# EasyEDA Pro project ProPrj_ArpiGlasses_Final2_2025-06-16.epro, board PCB_ArpiGlasses_1
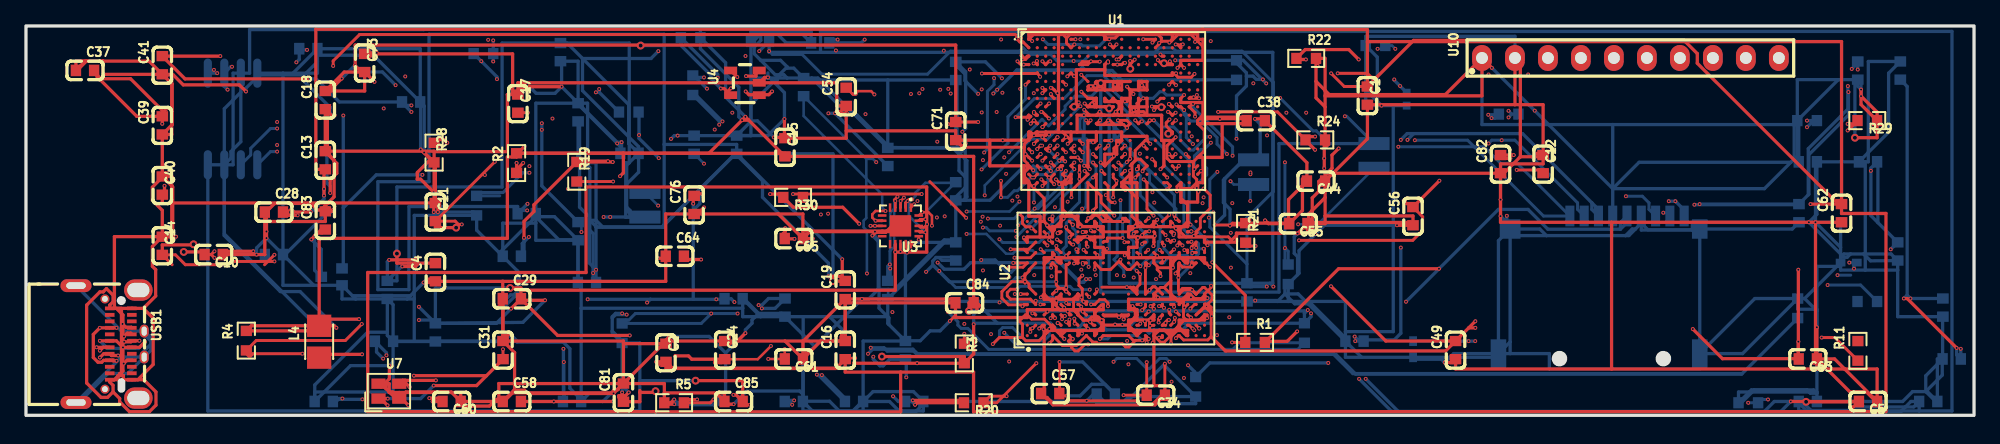
[diagram p3: board, top side]
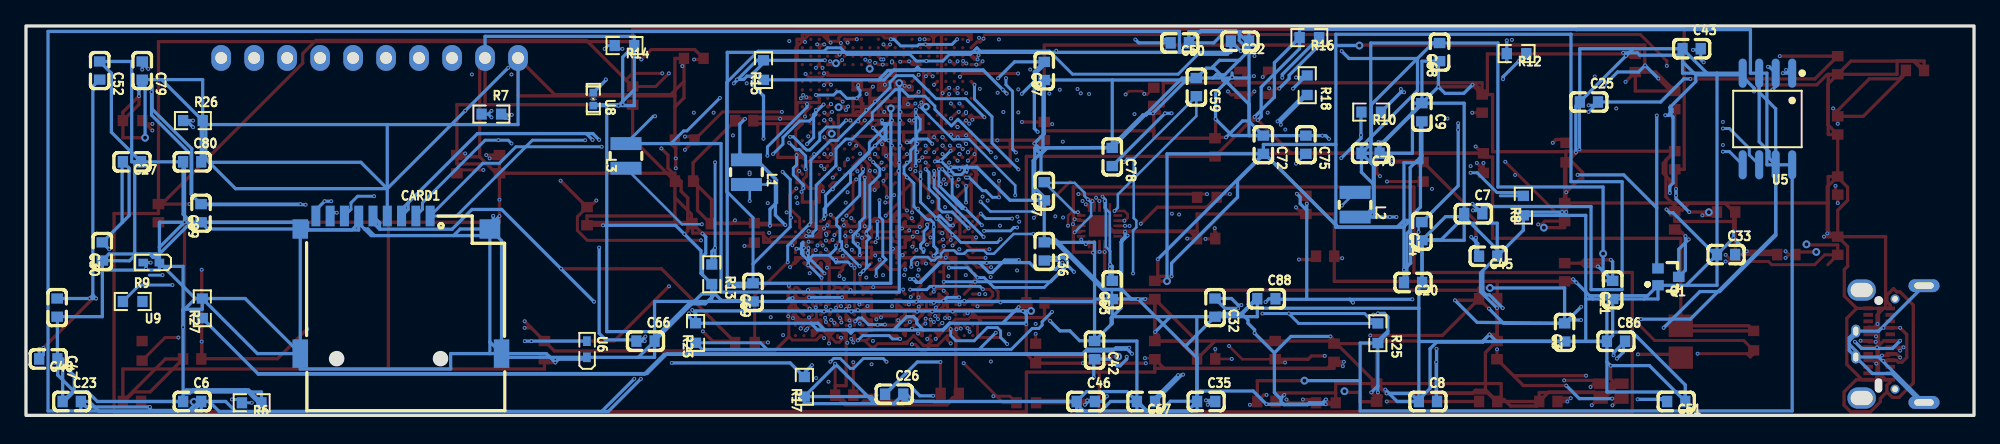
[diagram p4: board, bottom side, seen from below]

Outline 150 x 30 mm; copper layers: Top Layer, GND, Inner2, Inner3, Inner4, Bottom Layer. Coordinates in mm from the lower left corner of the outline.
Outline path: rectangle 0,30 150,0
Stack: Top Layer 0.035mm Outer layer thickness 1oz / Dielectric1 0.0994mm 3313 RC57% 4.2mil / GND 0.0152mm Inner layer thickness / Dielectric2 0.55mm 0.55mm H/H No copper / Inner2 0.0152mm Inner layer thickness / Dielectric3 0.1088mm 2116 RC54% 4.9mil / Inner3 0.0152mm Inner layer thickness / Dielectric4 0.55mm 0.55mm H/H No copper / Inner4 0.0152mm Inner layer thickness / Dielectric5 0.0994mm 3313 RC57% 4.2mil / Bottom Layer 0.035mm Outer layer thickness 1oz

## Design rules (mm)
template: User Custom Config
spacing Default (default): track to track 0.076, other pairs 0.076 to 0.076
track width Default (default): min 0.254, default 0.254, max 25.4
differential pair differentialPair (default): width min 0.127, default 0.254, max 2.54; gap min 0.152, default 0.152
via Default (default): diameter min 0.305, default 0.305, max 100.025; hole min 0.152, default 0.152, max 59.995

## Placement (name value [footprint] x y rotation side)
C1  2.2uf  [C0603]  103.29 24.63 270 top
C2  100nf  [C0603]  49.28 4.82 270 top
C3  22uf  [C0603]  31.52 6.39 90 bottom
C4  22uf  [C0603]  31.52 11.02 90 top
C5  22uf  [C0603]  141.84 1.07 180 top
C6  22uf  [C0603]  137.2 1.07 180 bottom
C7  22uf  [C0603]  38.56 15.53 180 bottom
C8  22uf  [C0603]  42.05 1.07 180 bottom
C9  22uf  [C0603]  42.51 23.35 270 bottom
C10  10uf  [C0603]  14.45 12.38 180 top
C11  220nf  [C0603]  31.52 15.66 270 top
C12  1uf  [C0603]  116.82 19.35 270 top
C13  100nf  [C0603]  23.05 19.65 90 top
C14  470nf  [C0603]  10.5 13.06 270 top
C15  1uf  [C0603]  58.44 20.65 270 top
C16  2.2uf  [C0603]  63.08 5.02 90 top
C17  470nf  [C0603]  37.88 24.02 270 top
C18  2.2uf  [C0603]  23.05 24.29 90 top
C19  2.2uf  [C0603]  63.08 9.66 90 top
C20  2.2uf  [C0603]  43.19 10.23 0 bottom
C21  2.2uf  [C0603]  27.83 9.66 90 bottom
C22  2.2uf  [C0603]  56.52 28.82 0 bottom
C23  2.2uf  [C0603]  146.48 1.07 180 bottom
C24  10uf  [C0603]  53.81 5.02 270 top
C25  2.2uf  [C0603]  29.66 24.14 180 bottom
C26  10uf  [C0603]  83.15 1.63 180 bottom
C27  100nf  [C0603]  141.84 19.53 0 bottom
C28  100nf  [C0603]  19.09 15.66 0 top
C29  100nf  [C0603]  37.41 8.98 0 top
C30  100nf  [C0603]  144.12 12.62 90 bottom
C31  12pf  [C0603]  36.73 5.02 90 top
C32  12pf  [C0603]  58.44 8.3 270 bottom
C33  1nf  [C0603]  19.09 12.38 180 bottom
C34  22uf  [C0603]  87 1.55 180 top
C35  2.2nf  [C0603]  59.12 1.07 180 bottom
C36  1uf  [C0603]  71.59 12.62 270 bottom
C37  1uf  [C0603]  4.55 26.57 0 top
C38  2.2nf  [C0603]  94.7 22.7 0 top
C39  2.2nf  [C0603]  10.5 22.34 90 top
C40  1uf  [C0603]  10.5 17.7 270 top
C41  100nf  [C0603]  10.5 26.97 90 top
C42  100nf  [C0603]  67.72 5.02 270 bottom
C43  100nf  [C0603]  21.74 28.25 180 bottom
C44  100nf  [C0603]  99.33 18.04 180 top
C45  1uf  [C0603]  37.41 12.26 0 bottom
C46  1uf  [C0603]  68.4 1.07 180 bottom
C47  1uf  [C0603]  147.6 8.3 90 bottom
C48  100nf  [C0603]  148.28 4.34 0 bottom
C49  100nf  [C0603]  110.08 5.02 90 top
C50  1uf  [C0603]  61.16 28.7 0 bottom
C51  1uf  [C0603]  22.93 1.07 0 bottom
C52  1uf  [C0603]  144.32 26.56 270 bottom
C53  100nf  [C0603]  66.36 9.66 90 bottom
C54  100nf  [C0603]  63.16 24.54 90 top
C55  100nf  [C0603]  97.97 14.77 180 top
C56  100nf  [C0603]  106.8 15.34 90 top
C57  1uf  [C0603]  78.87 1.68 0 top
C58  22uf  [C0603]  37.41 1.07 0 top
C59  4.7uf  [C0603]  59.88 25.29 270 bottom
C60  22uf  [C0603]  32.77 1.07 180 top
C61  1uf  [C0603]  59.12 4.34 180 top
C62  22uf  [C0603]  139.8 15.57 90 top
C63  22uf  [C0603]  137.2 4.34 180 top
C64  22uf  [C0603]  49.96 12.26 0 top
C65  1uf  [C0603]  59.12 13.62 180 top
C66  22uf  [C0603]  102.3 5.72 180 bottom
C67  22uf  [C0603]  63.76 1.07 0 bottom
C68  22uf  [C0603]  41.15 27.98 90 bottom
C69  22uf  [C0603]  94.02 9.47 90 bottom
C70  1uf  [C0603]  46.47 20.19 0 bottom
C71  1uf  [C0603]  71.59 21.9 90 top
C72  22uf  [C0603]  54.72 20.85 270 bottom
C73  22uf  [C0603]  26.08 27.15 270 top
C74  1nf  [C0603]  42.51 14.18 90 bottom
C75  100nf  [C0603]  51.45 20.85 270 bottom
C76  100nf  [C0603]  51.45 16.21 90 top
C77  22uf  [C0603]  71.59 17.26 90 bottom
C78  100nf  [C0603]  66.36 19.91 270 bottom
C79  12pf  [C0603]  141.05 26.56 270 bottom
C80  22uf  [C0603]  137.2 19.53 180 bottom
C81  10uf  [C0603]  46.01 1.75 90 top
C82  100nf  [C0603]  113.54 19.35 90 top
C83  100nf  [C0603]  23.05 15.02 90 top
C84  4.7uf  [C0603]  72.27 8.67 0 top
C85  100nf  [C0603]  54.49 1.07 0 top
C86  100nf  [C0603]  27.57 5.71 180 bottom
C87  4.7uf  [C0603]  71.59 26.53 90 bottom
C88  10uf  [C0603]  54.49 8.98 180 bottom
C89  100nf  [C0603]  136.52 15.57 90 bottom
CARD1  TF PUSH  [TF-SMD_TF-PUSH]  121.13 10.06 180 bottom
L1  1uH  [IND-SMD_L2.5-W2.0_AHP252010X]  94.53 18.73 270 bottom
L2  1uH  [IND-SMD_L2.5-W2.0_AHP252010X]  47.66 16.22 270 bottom
L3  1uH  [IND-SMD_L2.5-W2.0_AHP252010X]  103.8 19.99 90 bottom
L4  2.2uH  [IND-SMD_L2.5-W2.0_WPN252012H]  22.58 5.67 90 top
Q1  2SK3018W  [SOT-323_L2.0-W1.3-P1.30-LS2.1-TR]  23.54 10.67 0 bottom
R1  10  [R0603]  94.64 5.62 0 top
R2  10k  [R0603]  37.78 19.43 90 top
R3  10k  [R0603]  72.25 4.77 270 top
R4  10k  [R0603]  16.97 5.75 90 top
R5  150k  [R0603]  49.91 0.97 0 top
R6  10k  [R0603]  132.62 0.97 0 bottom
R7  20k  [R0603]  114.16 23.21 180 bottom
R8  6.04k  [R0603]  34.7 16.16 90 bottom
R9  10  [R0603]  141.78 8.77 180 bottom
R10  10k  [R0603]  46.42 23.36 0 bottom
R11  0  [R0603]  141.06 4.97 90 top
R12  100  [R0603]  35.23 27.87 0 bottom
R13  240  [R0603]  97.19 10.87 270 bottom
R14  510  [R0603]  103.91 28.49 0 bottom
R15  10k  [R0603]  93.21 26.6 90 bottom
R16  232k  [R0603]  51.18 29.1 0 bottom
R17  49.9k  [R0603]  90.07 2.2 90 bottom
R18  240  [R0603]  51.35 25.43 270 bottom
R19  240  [R0603]  42.41 18.77 270 top
R20  100k  [R0603]  72.98 0.97 180 top
R21  100k  [R0603]  93.92 14.05 270 top
R22  100k  [R0603]  98.58 27.5 0 top
R23  100k  [R0603]  98.44 6.34 90 bottom
R24  100k  [R0603]  99.28 21.22 0 top
R25  10k  [R0603]  45.9 6.33 270 bottom
R26  10k  [R0603]  137.15 22.71 180 bottom
R27  5.1k  [R0603]  136.42 8.24 90 bottom
R28  5.1k  [R0603]  31.42 20.24 270 top
R29  5.1k  [R0603]  141.78 22.71 180 top
R30  1.8k  [R0603]  59.07 16.79 180 top
U1  H616_C5365289  [BGA-284_L14.0-W12.0-P0.65-TL]  83.72 23.45 0 top
U2  K4F8E304HB-MGCJ  [BGA-200_L15.0-W10.0_K4F8E304HB-MGCJ]  83.92 10.54 90 top
U3  AXP313A_C5365290  [QFN-20_L3.0-W3.0-P0.40-BL-EP1.7]  67.34 14.6 180 top
U4  SY8089AAC  [SOT-23-5_L2.9-W1.6-P0.95-LS2.8-BL]  55.36 25.62 90 top
U5  W25Q128JWSIQ  [SOIC-8_L5.3-W5.3-P1.27-LS8.0-BL]  15.91 22.83 0 bottom
U6  SML-P12U2TT86R  [LED0402-R-RD]  106.81 5.09 90 bottom
U7  24MHz  [CRYSTAL-SMD_4P-L2.0-W1.6-BL-2]  27.94 1.86 0 top
U8  ESD0402  [D0402-BI]  106.31 24.36 270 bottom
U9  SML-P12U2TT86R  [LED0402-R-RD]  140.35 11.77 0 bottom
U10  MPU  [PIN HEADER 1X10PIN 2.54MM 10P]  112.11 27.53 90 top
USB1  UT12113-11601-7H  [USB-C-SMD_UT12113-11601-7H]  6.48 5.49 270 top

## Footprints (pads in the part's own frame, mm; a bottom-side part is the same pattern mirrored in y, then rotated)
BGA-200_L15.0-W10.0_K4F8E304HB-MGCJ
  round 0.248 smd: A1(-4.4,6.825) A2(-3.6,6.825) A3(-2.8,6.825) A4(-2,6.825) A5(-1.2,6.825) A8(1.2,6.825) A9(2,6.825) A10(2.8,6.825) A11(3.6,6.825) A12(4.4,6.825) AA1(-4.4,-6.175) AA2(-3.6,-6.175) AA3(-2.8,-6.175) AA4(-2,-6.175) AA5(-1.2,-6.175) AA8(1.2,-6.175) AA9(2,-6.175) AA10(2.8,-6.175) AA11(3.6,-6.175) AA12(4.4,-6.175) AB1(-4.4,-6.825) AB2(-3.6,-6.825) AB3(-2.8,-6.825) AB4(-2,-6.825) AB5(-1.2,-6.825) AB8(1.2,-6.825) AB9(2,-6.825) AB10(2.8,-6.825) AB11(3.6,-6.825) AB12(4.4,-6.825) B1(-4.4,6.175) B2(-3.6,6.175) B3(-2.8,6.175) B4(-2,6.175) B5(-1.2,6.175) B8(1.2,6.175) B9(2,6.175) B10(2.8,6.175) B11(3.6,6.175) B12(4.4,6.175) C1(-4.4,5.525) C2(-3.6,5.525) C3(-2.8,5.525) C4(-2,5.525) C5(-1.2,5.525) C8(1.2,5.525) C9(2,5.525) C10(2.8,5.525) C11(3.6,5.525) C12(4.4,5.525) D1(-4.4,4.875) D2(-3.6,4.875) D3(-2.8,4.875) D4(-2,4.875) D5(-1.2,4.875) D8(1.2,4.875) D9(2,4.875) D10(2.8,4.875) D11(3.6,4.875) D12(4.4,4.875) E1(-4.4,4.225) E2(-3.6,4.225) E3(-2.8,4.225) E4(-2,4.225) E5(-1.2,4.225) E8(1.2,4.225) E9(2,4.225) E10(2.8,4.225) E11(3.6,4.225) E12(4.4,4.225) F1(-4.4,3.575) F2(-3.6,3.575) F3(-2.8,3.575) F4(-2,3.575) F5(-1.2,3.575) F8(1.2,3.575) F9(2,3.575) F10(2.8,3.575) F11(3.6,3.575) F12(4.4,3.575) G1(-4.4,2.925) G2(-3.6,2.925) G3(-2.8,2.925) G4(-2,2.925) G5(-1.2,2.925) G8(1.2,2.925) G9(2,2.925) G10(2.8,2.925) G11(3.6,2.925) G12(4.4,2.925) H1(-4.4,2.275) H2(-3.6,2.275) H3(-2.8,2.275) H4(-2,2.275) H5(-1.2,2.275) H8(1.2,2.275) H9(2,2.275) H10(2.8,2.275) H11(3.6,2.275) H12(4.4,2.275) J1(-4.4,1.625) J2(-3.6,1.625) J3(-2.8,1.625) J4(-2,1.625) J5(-1.2,1.625) J8(1.2,1.625) J9(2,1.625) J10(2.8,1.625) J11(3.6,1.625) J12(4.4,1.625) K1(-4.4,0.975) K2(-3.6,0.975) K3(-2.8,0.975) K4(-2,0.975) K5(-1.2,0.975) K8(1.2,0.975) K9(2,0.975) K10(2.8,0.975) K11(3.6,0.975) K12(4.4,0.975) N1(-4.4,-0.975) N2(-3.6,-0.975) N3(-2.8,-0.975) N4(-2,-0.975) N5(-1.2,-0.975) N8(1.2,-0.975) N9(2,-0.975) N10(2.8,-0.975) N11(3.6,-0.975) N12(4.4,-0.975) P1(-4.4,-1.625) P2(-3.6,-1.625) P3(-2.8,-1.625) P4(-2,-1.625) P5(-1.2,-1.625) P8(1.2,-1.625) P9(2,-1.625) P10(2.8,-1.625) P11(3.6,-1.625) P12(4.4,-1.625) R1(-4.4,-2.275) R2(-3.6,-2.275) R3(-2.8,-2.275) R4(-2,-2.275) R5(-1.2,-2.275) R8(1.2,-2.275) R9(2,-2.275) R10(2.8,-2.275) R11(3.6,-2.275) R12(4.4,-2.275) T1(-4.4,-2.925) T2(-3.6,-2.925) T3(-2.8,-2.925) T4(-2,-2.925) T5(-1.2,-2.925) T8(1.2,-2.925) T9(2,-2.925) T10(2.8,-2.925) T11(3.6,-2.925) T12(4.4,-2.925) U1(-4.4,-3.575) U2(-3.6,-3.575) U3(-2.8,-3.575) U4(-2,-3.575) U5(-1.2,-3.575) U8(1.2,-3.575) U9(2,-3.575) U10(2.8,-3.575) U11(3.6,-3.575) U12(4.4,-3.575) V1(-4.4,-4.225) V2(-3.6,-4.225) V3(-2.8,-4.225) V4(-2,-4.225) V5(-1.2,-4.225) V8(1.2,-4.225) V9(2,-4.225) V10(2.8,-4.225) V11(3.6,-4.225) V12(4.4,-4.225) W1(-4.4,-4.875) W2(-3.6,-4.875) W3(-2.8,-4.875) W4(-2,-4.875) W5(-1.2,-4.875) W8(1.2,-4.875) W9(2,-4.875) W10(2.8,-4.875) W11(3.6,-4.875) W12(4.4,-4.875) Y1(-4.4,-5.525) Y2(-3.6,-5.525) Y3(-2.8,-5.525) Y4(-2,-5.525) Y5(-1.2,-5.525) Y8(1.2,-5.525) Y9(2,-5.525) Y10(2.8,-5.525) Y11(3.6,-5.525) Y12(4.4,-5.525)
BGA-284_L14.0-W12.0-P0.65-TL
  round 0.256 smd: A1(-6.5,5.525) A2(-5.85,5.525) A4(-4.55,5.525) A6(-3.25,5.525) A8(-1.95,5.525) A10(-0.65,5.525) A12(0.65,5.525) A14(1.95,5.525) A16(3.25,5.525) A18(4.55,5.525) A19(5.2,5.525) A20(5.849,5.525) A21(6.5,5.525) B1(-6.5,4.875) B2(-5.85,4.875) B3(-5.2,4.875) B4(-4.55,4.875) B5(-3.9,4.875) B6(-3.25,4.875) B7(-2.6,4.875) B8(-1.95,4.875) B9(-1.3,4.875) B10(-0.65,4.875) B11(0,4.875) B12(0.65,4.875) B13(1.3,4.875) B14(1.95,4.875) B15(2.6,4.875) B16(3.25,4.875) B17(3.9,4.875) B18(4.55,4.875) B19(5.2,4.875) B20(5.849,4.875) B21(6.5,4.875) C1(-6.5,4.225) C2(-5.85,4.225) C3(-5.2,4.225) C4(-4.55,4.225) C5(-3.9,4.225) C6(-3.25,4.225) C7(-2.6,4.225) C8(-1.95,4.225) C9(-1.3,4.225) C10(-0.65,4.225) C11(0,4.225) C12(0.65,4.225) C13(1.3,4.225) C14(1.95,4.225) C15(2.6,4.225) C16(3.25,4.225) C17(3.9,4.225) C18(4.55,4.225) C19(5.2,4.225) C20(5.849,4.225) D1(-6.5,3.575) D2(-5.85,3.575) D3(-5.2,3.575) D4(-4.55,3.575) D5(-3.9,3.575) D7(-2.6,3.575) D10(-0.65,3.575) D11(0,3.575) D12(0.65,3.575) D13(1.3,3.575) D14(1.95,3.575) D15(2.6,3.575) D16(3.25,3.575) D18(4.55,3.575) D19(5.2,3.575) D20(5.849,3.575) D21(6.5,3.575) E2(-5.85,2.925) E3(-5.2,2.925) E4(-4.55,2.925) E5(-3.9,2.925) E6(-3.25,2.925) E18(4.55,2.925) E19(5.2,2.925) E20(5.849,2.925) F1(-6.5,2.275) F2(-5.85,2.275) F3(-5.2,2.275) F4(-4.55,2.275) F5(-3.9,2.275) F8(-1.95,2.275) F9(-1.3,2.275) F10(-0.65,2.275) F11(0,2.275) F12(0.65,2.275) F13(1.3,2.275) F14(1.95,2.275) F15(2.6,2.275) F18(4.55,2.275) F19(5.2,2.275) F20(5.849,2.275) F21(6.5,2.275) G2(-5.85,1.625) G3(-5.2,1.625) G4(-4.55,1.625) G5(-3.9,1.625) G6(-3.25,1.625) G8(-1.95,1.625) G9(-1.3,1.625) G10(-0.65,1.625) G11(0,1.625) G12(0.65,1.625) G13(1.3,1.625) G14(1.95,1.625) G15(2.6,1.625) G17(3.9,1.625) G18(4.55,1.625) G19(5.2,1.625) G20(5.849,1.625) G21(6.5,1.625) H1(-6.5,0.975) H2(-5.85,0.975) H3(-5.2,0.975) H4(-4.55,0.975) H5(-3.9,0.975) H6(-3.25,0.975) H8(-1.95,0.975) H9(-1.3,0.975) H10(-0.65,0.975) H11(0,0.975) H12(0.65,0.975) H13(1.3,0.975) H14(1.95,0.975) H15(2.6,0.975) H17(3.9,0.975) H18(4.55,0.975) H19(5.2,0.975) H20(5.849,0.975) J2(-5.85,0.325) J3(-5.2,0.325) J6(-3.25,0.325) J8(-1.95,0.325) J9(-1.3,0.325) J10(-0.65,0.325) J11(0,0.325) J12(0.65,0.325) J13(1.3,0.325) J14(1.95,0.325) J15(2.6,0.325) J17(3.9,0.325) J18(4.55,0.325) J19(5.2,0.325) J20(5.849,0.325) J21(6.5,0.325) K1(-6.5,-0.325) K2(-5.85,-0.325) K3(-5.2,-0.325) K4(-4.55,-0.325) K5(-3.9,-0.325) K6(-3.25,-0.325) K8(-1.95,-0.325) K9(-1.3,-0.325) K10(-0.65,-0.325) K11(0,-0.325) K12(0.65,-0.325) K13(1.3,-0.325) K14(1.95,-0.325) K15(2.6,-0.325) K18(4.55,-0.325) K19(5.2,-0.325) K20(5.849,-0.325) L2(-5.85,-0.975) L3(-5.2,-0.975) L4(-4.55,-0.975) L5(-3.9,-0.975) L6(-3.25,-0.975) L8(-1.95,-0.975) L9(-1.3,-0.975) L10(-0.65,-0.975) L11(0,-0.975) L12(0.65,-0.975) L13(1.3,-0.975) L14(1.95,-0.975) L15(2.6,-0.975) L18(4.55,-0.975) L19(5.2,-0.975) L20(5.849,-0.975) L21(6.5,-0.975) M1(-6.5,-1.625) M2(-5.85,-1.625) M3(-5.2,-1.625) M18(4.55,-1.625) M19(5.2,-1.625) M20(5.849,-1.625) N2(-5.85,-2.275) N3(-5.2,-2.275) N4(-4.55,-2.275) N5(-3.9,-2.275) N6(-3.25,-2.275) N7(-2.6,-2.275) N9(-1.3,-2.275) N10(-0.65,-2.275) N12(0.65,-2.275) N13(1.3,-2.275) N15(2.6,-2.275) N16(3.25,-2.275) N18(4.55,-2.275) N19(5.2,-2.275) N20(5.849,-2.275) N21(6.5,-2.275) P1(-6.5,-2.925) P2(-5.85,-2.925) P3(-5.2,-2.925) P4(-4.55,-2.925) P5(-3.9,-2.925) P6(-3.25,-2.925) P7(-2.6,-2.925) P9(-1.3,-2.925) P10(-0.65,-2.925) P12(0.65,-2.925) P13(1.3,-2.925) P15(2.6,-2.925) P16(3.25,-2.925) P18(4.55,-2.925) P20(5.849,-2.925) P21(6.5,-2.925) R1(-6.5,-3.575) R2(-5.85,-3.575) R3(-5.2,-3.575) R4(-4.55,-3.575) R5(-3.9,-3.575) R6(-3.25,-3.575) R9(-1.3,-3.575) R12(0.65,-3.575) R15(2.6,-3.575) R18(4.55,-3.575) R19(5.2,-3.575) R20(5.849,-3.575) R21(6.5,-3.575) T1(-6.5,-4.225) T2(-5.85,-4.225) T3(-5.2,-4.225) T4(-4.55,-4.225) T5(-3.9,-4.225) T6(-3.25,-4.225) T7(-2.6,-4.225) T8(-1.95,-4.225) T9(-1.3,-4.225) T10(-0.65,-4.225) T11(0,-4.225) T12(0.65,-4.225) T14(1.95,-4.225) T15(2.6,-4.225) T16(3.25,-4.225) T17(3.9,-4.225) T18(4.55,-4.225) T20(5.849,-4.225) T21(6.5,-4.225) U1(-6.5,-4.875) U2(-5.85,-4.875) U3(-5.2,-4.875) U4(-4.55,-4.875) U5(-3.9,-4.875) U6(-3.25,-4.875) U8(-1.95,-4.875) U9(-1.3,-4.875) U10(-0.65,-4.875) U11(0,-4.875) U12(0.65,-4.875) U13(1.3,-4.875) U14(1.95,-4.875) U15(2.6,-4.875) U16(3.25,-4.875) U17(3.9,-4.875) U18(4.55,-4.875) U19(5.2,-4.875) U20(5.849,-4.875) U21(6.5,-4.875) V1(-6.5,-5.525) V2(-5.85,-5.525) V3(-5.2,-5.525) V5(-3.9,-5.525) V8(-1.95,-5.525) V10(-0.65,-5.525) V12(0.65,-5.525) V15(2.6,-5.525) V17(3.9,-5.525) V19(5.2,-5.525) V20(5.849,-5.525) V21(6.5,-5.525)
C0603
  rect 0.8x0.9 smd: 1(-0.7,0) 2(0.7,0)
CRYSTAL-SMD_4P-L2.0-W1.6-BL-2
  rect 1.1x0.8 smd: 1(-0.8,-0.575) 2(0.8,-0.575) 3(0.8,0.575) 4(-0.8,0.575)
D0402-BI
  rect 0.6x0.6 smd: 1(-0.5,0) 2(0.5,0)
IND-SMD_L2.5-W2.0_AHP252010X
  rect 1x2.4 smd: 1(-0.95,0) 2(0.95,0)
IND-SMD_L2.5-W2.0_WPN252012H
  rect 1.724x1.87 smd: 1(1.228,0) 2(-1.228,0)
LED0402-R-RD
  rect 0.75x0.6 smd: 1(0.623,0) 2(-0.623,0)
PIN HEADER 1X10PIN 2.54MM 10P
  oval 2x1.524 hole 0.914: 1(0,0) 2(0,-2.54) 3(0,-5.08) 4(0,-7.62) 5(0,-10.16) 6(0,-12.7) 7(0,-15.24) 8(0,-17.78) 9(0,-20.32) 10(0,-22.86)
QFN-20_L3.0-W3.0-P0.40-BL-EP1.7
  rect 0.2x0.665 smd: 1(-0.8,-1.407) 2(-0.4,-1.407) 3(0,-1.407) 4(0.4,-1.407) 5(0.8,-1.407) 11(0.8,1.407) 12(0.4,1.407) 13(0,1.407) 14(-0.4,1.407) 15(-0.8,1.407)
  rect 0.665x0.2 smd: 6(1.407,-0.8) 7(1.407,-0.4) 8(1.407,0) 9(1.407,0.4) 10(1.407,0.8) 16(-1.407,0.8) 17(-1.407,0.4) 18(-1.407,0) 19(-1.407,-0.4) 20(-1.407,-0.8)
  rect 1.65x1.65 smd: 21(0,0)
R0603
  rect 0.806x0.864 smd: 1(-0.753,0) 2(0.753,0)
SOIC-8_L5.3-W5.3-P1.27-LS8.0-BL
  oval 0.63x2.25 smd: 1(-1.905,-3.53) 2(-0.635,-3.53) 3(0.635,-3.53) 4(1.905,-3.53) 5(1.905,3.53) 6(0.635,3.53) 7(-0.635,3.53) 8(-1.905,3.53)
SOT-23-5_L2.9-W1.6-P0.95-LS2.8-BL
  rect 0.6x1 smd: 1(-0.95,-1.1) 2(0,-1.1) 3(0.95,-1.1) 4(0.95,1.1) 5(-0.95,1.1)
SOT-323_L2.0-W1.3-P1.30-LS2.1-TR
  rect 0.9x0.8 smd: 1(0.8,0.65) 2(0.8,-0.65) 3(-0.8,0)
TF-SMD_TF-PUSH
  rect 0.7x1.6 smd: 1(2.25,5.3) 2(1.15,5.3) 3(0.05,5.3) 4(-1.05,5.3) 5(-2.15,5.3) 6(-3.25,5.3) 7(-4.35,5.3) 8(-5.45,5.3) CD(-6.55,5.3)
  rect 1.2x1.5 smd: 10(-7.75,4.3)
  rect 1.2x2.2 smd: 11(-7.75,-5.3) 12(7.75,-5.3)
  rect 1.6x1.5 smd: 13(6.85,4.3)
USB-C-SMD_UT12113-11601-7H
  round 0.7 hole 0.45: 1(-3.475,-0.395) 1(3.475,-0.395)
  oval 1x2.4 hole 0.5x1.5: 2(-4.5,-2.625) 2(4.5,-2.625)
  oval 1x0.7 hole 0.7x0.4: 2(-1,2.625) 2(1,2.625)
  oval 1.65x2.2 hole 1.1x1.7: 13(-4.16,2.176) 13(4.16,2.176)
  rect 0.3x0.74 smd: A1(-2.75,1.675) A2(-2.25,1.675) A3(-1.75,1.675) A4(-1.25,1.675) A5(-0.75,1.675) A6(-0.25,1.675) A7(0.25,1.675) A8(0.75,1.675) A9(1.25,1.675) A10(1.75,1.675) A11(2.25,1.675) A12(2.75,1.675) B1(2.75,-0.025) B2(2.251,-0.025) B3(1.75,-0.025) B4(1.25,-0.025) B5(0.75,-0.025) B6(0.251,-0.025) B7(-0.25,-0.025) B8(-0.75,-0.025) B9(-1.25,-0.025) B10(-1.75,-0.025) B11(-2.25,-0.025) B12(-2.749,-0.025)

## Nets
AGND: U1.H18
GND: C1.2 C2.1 C3.1 C4.1 C5.1 C6.1 C7.1 C8.1 C9.1 C10.1 C11.1 C12.1 C13.2 C14.1 C15.1 C16.2 C17.1 C18.1 C19.1 C20.1 C21.1 C22.1 C23.1 C24.1 C25.1 C26.2 C27.1 C28.1 C29.1 C30.1 C31.2 C32.2 C33.1 C34.1 C35.1 C36.1 C37.1 C38.1 C39.1 C40.1 C41.1 C42.1 C43.1 C44.1 C45.1 C46.1 C47.1 C48.1 C49.1 C50.1 C51.1 C52.1 C53.1 C54.1 C55.1 C56.1 C57.1 C58.1 C59.1 C60.1 C61.1 C62.1 C63.1 C64.1 C65.1 C66.2 C67.2 C68.1 C69.1 C70.1 C71.1 C72.1 C73.1 C74.1 C75.1 C76.1 C77.1 C78.1 C80.1 C81.2 C82.1 C83.2 C84.1 C85.1 C86.1 C87.1 C88.1 C89.1 CARD1.6 CARD1.10 CARD1.11 CARD1.12 CARD1.13 Q1.1 R5.1 R6.1 R8.1 R13.2 R14.1 R17.1 R27.2 R28.2 U1.A1 U1.A10 U1.A18 U1.A21 U1.B6 U1.B16 U1.D19 U1.F14 U1.F15 U1.G13 U1.G14 U1.G15 U1.H10 U1.H11 U1.H12 U1.H13 U1.H14 U1.H15 U1.H19 U1.J12 U1.J13 U1.J14 U1.J15 U1.K8 U1.K9 U1.K10 U1.K11 U1.K12 U1.K13 U1.K14 U1.K15 U1.L21 U1.M1 U1.M2 U1.M3 U1.N6 U1.N9 U1.N12 U1.N15 U1.N18 U1.P3 U1.R5 U1.R21 U1.T1 U1.T3 U1.T8 U1.T10 U1.T15 U1.T17 U1.U6 U1.U13 U1.V1 U1.V5 U1.V12 U1.V19 U1.V21 U2.A3 U2.A10 U2.AB3 U2.AB5 U2.AB8 U2.AB10 U2.C1 U2.C5 U2.C8 U2.C12 U2.D2 U2.D4 U2.D9 U2.D11 U2.E1 U2.E5 U2.E8 U2.E12 U2.G1 U2.G3 U2.G5 U2.G8 U2.G10 U2.G12 U2.J1 U2.J3 U2.J10 U2.J12 U2.K2 U2.K4 U2.K9 U2.K11 U2.N2 U2.N4 U2.N9 U2.N11 U2.P1 U2.P3 U2.P10 U2.P12 U2.T1 U2.T3 U2.T5 U2.T8 U2.T10 U2.T12 U2.V1 U2.V5 U2.V8 U2.V12 U2.W2 U2.W4 U2.W9 U2.W11 U2.Y1 U2.Y5 U2.Y8 U2.Y12 U3.9 U3.21 U4.2 U5.4 U6.2 U7.2 U7.4 U8.2 U9.2 U10.2 USB1.A1 USB1.A12 USB1.B1 USB1.B12
VCC-5V: C60.2 C66.1 C67.1 C76.2 C77.2 C79.1 C86.2 C87.2 C88.2 C89.2 R15.2 R16.1 R17.2 U3.2 U3.17 U3.20 U4.4 U4.5 U8.1 USB1.A4 USB1.A9 USB1.B4 USB1.B9
VCC-DRAM: C34.2 C35.2 C36.2 C37.2 C38.2 C39.2 C42.2 C43.2 C44.2 C45.2 C46.2 C47.2 C48.2 C49.2 C50.2 C51.2 C52.2 C53.2 C54.2 C55.2 C64.2 C65.2 L1.1 R18.1 R19.1 R20.2 R21.1 U1.L9 U1.L10 U1.L11 U1.L12 U1.L13 U2.A4 U2.A9 U2.AA3 U2.AA5 U2.AA8 U2.AA10 U2.AB4 U2.AB9 U2.B3 U2.B5 U2.B8 U2.B10 U2.D1 U2.D5 U2.D8 U2.D12 U2.F3 U2.F5 U2.F8 U2.F10 U2.H1 U2.H5 U2.H8 U2.H12 U2.K1 U2.K3 U2.K10 U2.K12 U2.N1 U2.N3 U2.N10 U2.N12 U2.R1 U2.R5 U2.R8 U2.R12 U2.U3 U2.U5 U2.U8 U2.U10 U2.W1 U2.W5 U2.W8 U2.W12 U3.4
VCC-PC: C1.1 C2.2 C3.2 C13.1 C16.1 C28.2 C29.2 C62.2 U1.D10 U1.E18 U1.F5 U1.J6 U1.M18 U3.12
VCC-PG: C24.2 C25.2 C26.1 C27.2 C30.2 C40.2 C41.2 C56.2 C57.2 C58.2 C63.2 R7.2 R10.2 U1.D7 U1.D11 U1.D12 U1.F18 U1.H17 U1.H20 U1.L14 U2.F1 U2.F12 U2.G4 U2.G9 U2.T4 U2.T9 U2.U1 U2.U12 U3.15
VCC-RTC: C59.2 R14.2 U3.7
VDD-CPU: C4.2 C5.2 C6.2 C21.2 C22.2 C23.2 C68.2 C69.2 C70.2 L2.2 U1.H8 U1.H9 U1.J8 U1.J9 U1.J10 U1.J11
VDD-CPUFB: U1.L8 U3.1
VDD-GPU: C7.2 C8.2 C9.2 C18.2 C19.2 C20.2 C71.2 C72.2 C73.2 L3.2 U1.F9 U1.F10 U1.F11 U1.F12 U1.F13 U1.G8 U1.G9 U1.G10 U1.G11 U1.G12
VDD-GPUFB: U1.F8 U3.16
AC-AVCC: C10.2 U1.D18
AC-VRA1: C12.2 U1.C17
AP-CK32KO: U1.C8
AP-RESET: C74.2 R12.2 U3.13
AP-WAKE-BT: U1.C3
BT-PCM-CLK: U1.B10
BT-PCM-DIN: U1.C10
BT-PCM-DOUT: U1.B9
BT-PCM-SYNC: U1.C9
BT-REG-ON: U1.B2
BT-UART-CTS: U1.C4
BT-UART-RTS: U1.B3
BT-UART-RX: U1.A4
BT-UART-TX: U1.B4
BT-WAKE-AP: U1.B8
C33_2: C33.2
CD310: C82.2 CARD1.CD Q1.2 R22.1
DCDCE: C15.2 C79.2 C80.2 C81.1 C84.2 C85.2 CARD1.4 L4.1 R2.2 R3.2 R4.2 R16.2 R22.2 R23.2 R24.2 R25.2 R26.2 R29.1 U5.3 U5.7 U5.8 U10.1
DCXO-XIN: C31.1 U1.B11 U7.1
DCXO-XOUT: C32.1 U1.C12 U7.3
DXLDO-OUT: C11.2 U1.D13
EPHY-RTX: R8.2 U1.B19
EPHY-RXN: U1.B21
EPHY-RXP: U1.B20
EPHY-TXN: U1.A20
EPHY-TXP: U1.A19
HCEC: U1.G17
HHPD: U1.G18
HSCL: U1.F19
HSDA: U1.G21
HTX0N: U1.E20
HTX0P: U1.E19
HTX1N: U1.D21
HTX1P: U1.D20
HTX2N: U1.C20
HTX2P: U1.C19
HTXCN: U1.F21
HTXCP: U1.F20
LINEOUTL: U1.G19
LINEOUTR: U1.G20
LRADC: R7.1 U1.L18
PC1: U1.C2
PC5: R6.2 U1.D3
PC6: R4.1 U1.E2
PC7: U1.F4
PC8: U1.E3
PC9: R11.1 U1.F1
PC10: U1.F2
PC11: U1.F3
PC12: U1.G2
PC14: U1.H1
PC15: U1.H2
PC16: U1.H3
PH4: U1.A14
PH10/IR_RX: U1.B13
PI0: U1.H6
PI1: U1.D4
PI2: U1.G6
PI3: U1.E4
PI4: U1.G5
PI5: U1.H4 U10.4
PI6: U1.H5
PI7: R26.1 U1.G4 U10.3
PI8: R25.1 U1.E6
PI9: U1.D5
PI10: U1.L5
PI11: U1.K4
PI12: U1.K5
PI13: U1.E5
PI14: U1.L6
PI15: U1.L4
PI16: U1.K6
PMU-IRQ: U3.11
PMU-SCL: U3.6
PMU-SDA: U3.5
PMU_IRQ: R11.2
PWRON: C75.2 U3.14
RESET: R10.1 R12.1 U1.A16
REXT: R5.2 U1.K18
RX0: U1.D15
RX5: U1.C15
SA0: U1.U17 U2.H2 U2.R2
SA1: U1.V17 U2.J2 U2.P2
SA2: U1.T21 U2.H9 U2.R9
SA3: U1.R20 U2.H10 U2.R10
SA4: U1.R18 U2.H11 U2.R11
SA5: U1.T16 U2.J11 U2.P11
SCKE0: U1.V15 U2.J4 U2.P4
SCKE1: U1.P13 U2.J5 U2.P5
SCKN: U1.U14 U2.J9 U2.P9
SCKP: U1.T14 U2.J8 U2.P8
SCS0: U1.T18 U2.H4 U2.R4
SCS1: U1.P15 U2.H3 U2.R3
SDC0-CLK: CARD1.5 R1.2
SDC0-CMD: CARD1.3 R24.1 U1.K3
SDC0-D0: CARD1.7 U1.J3
SDC0-D1: CARD1.8 U1.J2
SDC0-D2: CARD1.1 U1.L3
SDC0-D3: CARD1.2 U1.L2
SDC0-DET: C83.1 Q1.3 R23.1 U1.K2
SDQ0: U1.N3 U2.U11
SDQ1: U1.U4 U2.U9
SDQ2: U1.N2 U2.V11
SDQ3: U1.T4 U2.V9
SDQ4: U1.U3 U2.Y9
SDQ5: U1.P1 U2.AA11
SDQ6: U1.T2 U2.AA9
SDQ7: U1.P2 U2.Y11
SDQ8: U1.P5 U2.Y4
SDQ9: U1.V3 U2.V2
SDQ10: U1.P4 U2.Y2
SDQ11: U1.R4 U2.V4
SDQ12: U1.R6 U2.U2
SDQ13: U1.N4 U2.AA2
SDQ14: U1.P6 U2.U4
SDQ15: U1.N5 U2.AA4
SDQ16: U1.T11 U2.C4
SDQ17: U1.U12 U2.F4
SDQ18: U1.T12 U2.E4
SDQ19: U1.U9 U2.B4
SDQ20: U1.T6 U2.C2
SDQ21: U1.U5 U2.F2
SDQ22: U1.T7 U2.B2
SDQ23: U1.T5 U2.E2
SDQ24: U1.R9 U2.C9
SDQ25: U1.P7 U2.E9
SDQ26: U1.N7 U2.F9
SDQ27: U1.P9 U2.B11
SDQ28: U1.P10 U2.C11
SDQ29: U1.U11 U2.F11
SDQ30: U1.P12 U2.B9
SDQ31: U1.R12 U2.E11
SDQM0: U1.U1 U2.Y10
SDQM1: U1.R3 U2.Y3
SDQM2: U1.T9 U2.C3
SDQM3: U1.N10 U2.C10
SDQS0N: U1.R1 U2.V10
SDQS0P: U1.R2 U2.W10
SDQS1N: U1.V2 U2.V3
SDQS1P: U1.U2 U2.W3
SDQS2N: U1.U8 U2.E3
SDQS2P: U1.V8 U2.D3
SDQS3N: U1.U10 U2.E10
SDQS3P: U1.V10 U2.D10
SPI0_CLK: U1.B1 U5.6
SPI0_CS0: R2.1 U1.D1 U5.1
SPI0_MISO: R3.1 U1.D2 U5.2
SPI0_MOSI: U1.C1 U5.5
SPI1_CLK: U1.C14
SPI1_CS0: U1.B14
SPI1_CS1: U1.A12
SPI1_MISO: U1.C13
SPI1_MOSI: U1.B12
SRST: U1.U21 U2.T11
STATUS-LED: R30.1 U1.G3
TV-OUT: U1.J21
TX0: U1.D16
TX5: U1.B15
U1_A6: R9.1 U1.A6
U1_K1: R1.1 U1.K1
U1_L15: R13.1 U1.L15
U2_A5: R18.2 U2.A5
U2_A8: R19.2 U2.A8
U2_G2: R20.1 U2.G2
U2_T2: R21.2 U2.T2
U3_3: L1.2 U3.3
U3_8: C61.2 U3.8
U3_18: L3.1 U3.18
U3_19: L2.1 U3.19
U4_1: C78.2 R15.1 U4.1
U4_3: L4.2 U4.3
U6_1: R29.2 U6.1
U9_1: R30.2 U9.1
U10_5: U10.5
U10_6: U10.6
U10_7: U10.7
U10_8: U10.8
U10_9: U10.9
U10_10: U10.10
USB0-DM: U1.J19 USB1.A7 USB1.B7
USB0-DP: U1.J20 USB1.A6 USB1.B6
USB1-DM: U1.M19
USB1-DP: U1.M20
USB1_1: USB1.1
USB1_2: USB1.2
USB1_A5: R28.1 USB1.A5
USB1_B5: R27.1 USB1.B5
USB2-DM: U1.K19
USB2-DP: U1.K20
USB3-DM: U1.L19
USB3-DP: U1.L20
VRA1: C17.2 U1.J18
VRA2: C14.2 U1.J17
WL-REG-ON: U1.A2
WL-SDIO-CLK: R9.2
WL-SDIO-CMD: U1.C7
WL-SDIO-D0: U1.C6
WL-SDIO-D1: U1.B5
WL-SDIO-D2: U1.C5
WL-SDIO-D3: U1.B7
WL-WAKE-AP: U1.A8

Pads without a net: U1 B17 B18 C11 C16 C18 D14 N13 N16 N19 N20 N21 P16 P18 P20 P21 R15 R19 T20 U15 U16 U18 U19 U20 V20; U2 A1 A2 A11 A12 AA1 AA12 AB1 AB2 AB11 AB12 B1 B12 G11 K5 K8 N5 N8; U3 10; USB1 13 A2 A3 A8 A10 A11 B2 B3 B8 B10 B11

## Via types
v1: diameter 0.305, hole 0.152, Top Layer to Bottom Layer, 952 vias
v2: diameter 0.61, hole 0.305, Top Layer to Bottom Layer, 21 vias

## Routing (per net, layer and track width the routed paths; a pad name or vN(x,y) marks a point on that pad's centre or on a via; arc(x,y) is an arc through that point)
GND: length 2544.6
  Top Layer w0.2: 65.94,14.1 65.94,14.18 U3.9
  Top Layer w0.225: 87.64,9.85 88.15,10.36 ; 87.64,9.85 87.36,9.85 U2.T5 86.91,9.34 v1(87.16,9.09) ; 87.64,9.85 U2.V5 ; 82.32,7.57 82.07,7.57 81.84,7.34 ; 82.32,7.57 82.3,7.6 ; 82.32,7.57 82.41,7.57 ; 85.41,7.6 U2.P3 85.46,7.83 85.46,7.98 ; 85.41,7.6 84.9,7.09 ; 85.41,7.6 85.41,8.03 ; 85.41,7.6 85.41,7.45 U2.N2 85.55,6.29 ; 86.51,6.54 86.51,7.4 U2.T3 ; 82.44,7.57 82.41,7.57 ; 82.44,7.57 82.44,7.6 ; 82.44,7.57 82.44,7.45 82.83,7.06 ; 82.44,7.57 82.58,7.57 v1(82.83,7.32) 82.83,7.06 ; 82.41,7.57 82.44,7.6 ; 82.41,7.57 82.19,7.34 81.84,7.34 ; v1(78.15,9.09) U2.C5 ; U2.C5 78.4,11.63 ; U2.C5 79.05,8.69 ; 85.46,7.98 85.41,8.03 ; 85.46,7.98 85.46,8.16 v1(85.21,8.41) 85.03,8.41 ; 85.46,7.98 85.55,7.89 ; 85.41,8.03 85.41,8.03 85.15,8.29 84.9,8.29 85.03,8.41 ; 85.41,8.03 85.3,8.14 ; U2.K11 U2.N11 85.07,14.31 85.16,14.31 v1(85.41,14.57) 85.55,14.7 ; U2.K11 82.8,14.14 v1(82.55,14.39) 82.4,14.54 82.3,14.64 82.29,14.65 ; U2.K11 82.55,14.54 82.44,14.65 82.44,14.8 ; 79.41,11.88 79.49,11.95 ; 79.41,11.88 79.16,12.13 78.91,12.13 78.4,11.63 ; 79.41,11.88 79.56,11.74 U2.E8 79.49,11.95 ; 79.49,11.95 79.67,12.13 ; 79.49,11.95 79.43,12.01 79.43,12.16 v1(79.18,12.16) ; v1(87.69,3.98) 87.69,2.28 ; v1(74.45,5.49) 74.96,6 76.73,6 ; 80.66,8.11 79.65,8.11 79.21,8.54 ; 80.66,8.11 80.66,9 U2.G5 81.02,9.34 v1(81.27,9.09) ; 80.66,8.11 81,7.77 81.03,7.74 ; 82.83,7.06 82.83,7.06 ; 82.83,7.06 U2.K2 ; 82.83,7.06 82.83,6.82 ; 82.83,7.06 U2.K2 ; 90.22,17.67 90.03,17.48 v1(90.29,17.23) ; 81.03,7.74 81.42,7.34 81.84,7.34 ; 81.03,7.74 U2.G3 81.42,7.32 81.82,7.32 81.84,7.34 ; v1(87.02,14.65) 86.85,14.82 86.59,14.57 86.09,14.57 85.83,14.82 85.58,14.82 85.3,14.54 ; 88.32,11.88 U2.V8 ; 88.32,11.88 88.32,11.8 ; 88.32,11.88 88.8,12.36 ; 79.19,14.43 U2.E12 v1(79.9,15.14) ; 79.19,14.43 79.19,14.28 U2.D11 78.63,14.56 v1(78.63,14.63) U2.C12 78.91,14.43 79.19,14.43 ; 80.82,13.52 81.21,13.52 81.43,13.74 81.46,13.77 v1(81.72,13.77) 81.97,13.52 82.12,13.52 82.3,13.34 ; 80.82,13.52 U2.G10 ; 80.82,13.52 80.7,13.52 ; 82.3,7.99 82.44,8.14 82.81,8.5 82.91,8.5 U2.K4 ; U2.T12 86.97,14.94 v1(87.1,15.07) ; v1(79.18,12.16) 78.92,12.16 78.67,11.9 78.56,11.9 U2.C8 78.4,11.63 ; v1(79.18,12.16) 79.18,12.41 U2.D9 ; 81.17,6.28 81.16,6.3 ; 81.17,6.28 81.03,6.14 U2.G1 81.16,6.3 ; 81.17,6.28 81.19,6.3 ; 81.16,6.3 81,6.45 80.92,6.54 ; 81.16,6.3 81.16,6.3 81.19,6.3 ; 88.94,8.83 89.05,8.94 U2.Y5 ; 88.94,8.83 88.69,8.83 ; 88.94,8.83 88.94,8.68 U2.W4 ; U2.T8 87.1,11.49 87.1,11.23 87.36,10.98 v1(87.36,10.72) ; 85.03,8.41 U2.N4 ; 88.15,6.07 U2.V1 ; 88.15,6.07 88.11,6.1 ; 88.15,6.07 88.17,6.05 ; U2.V1 88.11,6.1 ; U2.V1 88.29,6.28 ; C57.1 78.48,1.37 79.08,0.79 86.93,0.79 C34.1 87.44,1.55 86.75,0.86 85.74,0.86 85.48,1.12 v1(81.67,1.12) ; 89.64,9.34 U2.Y5 ; 89.64,9.34 89.54,9.25 ; 89.64,9.34 89.99,8.99 90.5,8.99 90.75,9.25 v1(90.97,9.03) ; U2.Y5 89.54,9.25 ; 80.09,6.54 U2.E1 ; U2.E1 v1(79.95,5.89) ; U2.E1 79.3,6.54 79.19,6.65 ; v1(84.61,12.32) U2.N9 ; v1(86.8,13.04) 86.85,13.04 U2.T10 ; 88.11,6.1 87.64,6.57 87.28,6.57 87.25,6.54 U2.T1 87.36,5.63 87.64,5.63 88.11,6.1 ; v1(81.17,14.51) 81.15,14.54 81,14.69 ; 82.44,7.6 82.3,7.74 ; 79.21,8.54 79.34,8.54 v1(79.34,8.83) 79.34,9.09 79.44,9.09 U2.E5 ; 79.21,8.54 U2.D4 ; 79.21,8.54 79.21,8.85 79.3,8.94 ; 81.19,6.3 v1(81.31,6.3) ; 81.19,6.3 81.42,6.54 ; v1(89.68,14.69) U2.Y12 89.05,14.54 88.89,14.38 88.89,14.14 ; 88.89,14.14 89.28,13.75 92.58,13.75 92.83,13.5 ; 88.89,14.14 U2.W11 v1(88.55,14.39) v1(88.29,14.65) ; 89.54,9.25 89.45,9.15 89.24,8.94 89.13,8.83 89.13,7.56 89.38,7.31 ; 89.54,9.25 v1(89.7,9.09) ; U2.V12 88.29,14.8 v1(88.29,14.65) ; 76.73,6 76.99,5.74 78,5.74 U2.C1 78.91,6.65 78.94,6.65 ; 76.73,6 76.73,7.01 76.48,7.27 76.95,7.74 U2.A3 77.43,7.41 78.43,7.41 78.94,6.9 78.94,6.81 ; 88.17,6.05 88.67,6.56 ; 88.17,6.05 v1(88.17,5.54) ; 78.94,6.65 78.94,6.81 ; 78.94,6.65 79.19,6.65 ; 78.94,6.81 U2.D2 79.19,6.8 79.19,6.65 ; 78.94,6.81 v1(78.8,6.65) ; v1(71.15,7.27) 71.57,7.7 ; v1(88.29,14.65) 88.15,14.65 ; 92.83,13.5 93.34,14.01 v1(97.91,14.01) ; 92.83,13.5 92.67,13.34 ; v1(91.26,9.98) 91.26,9.85 U2.AB5 ; v1(88.32,11.37) 88.32,11.8 ; 88.32,11.8 88.66,12.13 88.91,12.13 89.16,11.88 ; 88.32,11.8 88.15,11.63 ; 88.8,6.79 U2.Y1 89.34,6.14 88.93,6.56 88.67,6.56 ; 80.6,12.13 U2.G8 v1(80.7,11.7) ; 80.24,15.45 79.82,15.87 ; 80.24,15.45 80.49,15.45 U2.G12 81.4,14.54 ; 80.24,15.45 80.21,15.45 80.1,15.34 ; 82.31,6.41 82.45,6.54 82.46,6.56 ; 82.31,6.41 82.3,6.39 ; 82.31,6.41 82.19,6.54 ; 82.31,6.41 82.44,6.28 ; 82.44,14.8 82.3,14.66 82.29,14.65 ; 82.44,14.8 82.3,14.94 82.29,14.65 ; 82.83,6.82 U2.K2 ; 82.83,6.82 82.83,6.56 ; 82.83,6.82 82.55,6.54 82.44,6.43 82.44,6.28 ; 88.69,8.83 88.66,8.83 U2.V5 ; 88.69,8.83 88.43,9.09 U2.V5 ; U2.W2 88.4,6.54 88.29,6.43 88.29,6.28 ; U2.W2 88.67,6.81 88.67,6.56 ; U2.W2 89.17,7.31 89.38,7.31 ; 90.35,12.13 U2.AB8 90.91,11.74 90.91,11.67 v1(91.17,11.42) ; v1(83.24,12.83) U2.K9 ; 88.29,6.28 88.04,6.28 87.78,6.54 ; 89.25,11.97 89.45,11.77 ; 89.25,11.97 89.42,12.13 ; 89.25,11.97 89.08,12.13 ; 89.25,11.97 89.16,11.88 ; 82.29,14.65 82.19,14.54 ; v1(90.98,13.11) U2.AB10 ; 84.9,6.79 U2.P1 85.94,6.54 ; 89.38,7.31 90.32,7.31 U2.AB3 90.95,7.74 v1(90.95,7.49) ; 89.16,11.88 89.31,11.74 U2.Y8 ; U2.A10 76.84,13.59 v1(76.84,13.71) ; 88.15,11.37 87.22,11.37 ; v1(86.59,7.31) 86.85,7.56 ; 82.3,7.89 82.55,8.14 ; v1(85.62,13.67) 85.55,13.59 ; 82.44,6.28 82.3,6.14
  Top Layer w0.232: U2.C12 78.4,16.72 77.22,17.9 77.19,17.92 77.13,17.99 ; 89.45,16.21 88.94,16.72 88.94,17.48 ; 89.89,19.45 89.89,19.55 U1.R21 ; 89.89,19.45 89.89,18.43 90.15,18.18 90.15,17.92 ; 89.89,19.45 89.79,19.55 88.11,19.55 87.86,19.8 87.86,20.76 U1.N18 v1(88.52,21.43) ; 90.15,17.92 89.7,17.48 88.94,17.48 ; 90.15,17.92 U1.V21 ; 76.88,18.38 76.71,18.54 76.84,18.67 76.88,18.71 ; 76.88,18.38 76.88,18.71 ; 76.88,18.38 76.88,18.24 77.13,17.99 ; 76.88,18.38 77.22,18.04 U1.V1 77.15,17.99 77.13,17.99 ; 85.16,17.13 U1.V12 ; 85.16,17.13 85.16,15.33 U2.P12 85.67,14.82 ; 85.16,17.13 85.55,16.74 ; 85.16,17.13 85.16,19.37 ; U1.V12 U1.U13 v1(85.02,18.85) ; U1.V12 84.37,17.61 84.4,17.61 v1(84.65,17.36) ; U1.H13 84.79,24.19 v1(84.62,24.19) U1.H12 ; 72.1,20.69 72.13,20.66 76.88,20.66 ; 85.67,23.4 U1.K14 85.55,23.24 85.55,23.4 ; 85.67,23.4 86.04,23.4 86.32,23.12 86.32,23.77 ; 85.67,23.4 85.55,23.4 ; 85.67,23.4 85.67,23.77 ; v1(78.8,19.11) 78.63,19.11 ; 78.63,19.11 U1.T3 ; 78.63,19.11 v1(78.91,18.83) ; 80.47,18.21 80.07,17.81 79.81,17.81 ; 90.22,28.82 90.14,28.9 ; 90.22,28.82 U1.A21 90.14,28.9 ; 90.22,28.82 90.73,28.31 90.73,23.23 90.47,22.98 93.71,22.98 ; 90.14,28.9 89.71,29.33 88.69,29.33 88.19,28.82 ; 90.14,28.9 v1(90.02,28.77) ; v1(85.92,25.44) 85.92,25.69 85.89,25.72 ; v1(85.92,25.44) 85.67,25.18 ; v1(85.92,25.44) 86.18,25.18 86.32,25.07 86.32,25.72 ; v1(85.3,23.52) 85.55,23.77 85.55,24.03 85.8,24.28 U1.H14 ; v1(85.3,23.52) 85.3,23.4 ; v1(85.3,23.52) 85.02,23.77 U1.J13 ; v1(84.79,25.32) U1.G13 v1(85.27,24.76) ; v1(78.86,20.78) 78.61,20.52 U1.P3 78.66,20.38 v1(78.8,20.38) ; 76.88,20.66 76.88,20.91 77.57,21.61 ; 76.88,20.66 76.88,19.64 77.13,19.39 77.13,19.13 ; 76.88,18.71 77.31,19.14 ; 76.88,18.71 76.88,18.75 77.13,19 77.13,19.13 ; v1(86.57,20.92) 86.32,21.17 86.18,21.17 85.41,20.41 85.41,19.65 85.16,19.39 85.16,19.37 ; 88.14,28.82 87.43,28.82 ; 88.14,28.82 v1(88.05,28.72) ; 88.14,28.82 88.19,28.82 ; 88.14,28.82 88.19,28.88 ; 87.43,28.82 87.43,29.08 87.17,29.33 84.12,29.33 83.87,29.08 83.17,29.08 ; 87.43,28.82 87.43,28.78 ; 83.17,29.08 U1.A10 v1(83.41,28.97) ; 83.17,29.08 82.92,29.33 80.38,29.33 80.12,29.08 ; v1(89.17,24.68) 88.92,24.42 ; v1(85.98,18.8) 85.98,18.88 86.32,19.22 85.81,19.73 85.53,19.73 85.16,19.37 ; 83.32,24.17 83.32,24.17 U1.H10 ; 84.17,23.63 U1.J12 ; 84.17,23.63 v1(83.91,23.38) ; 84.17,23.63 84.17,23.97 83.97,24.17 U1.H11 83.47,24.17 83.47,24.17 ; 88.19,28.88 88.19,28.89 U1.A18 88.19,28.88 ; 88.19,28.88 88.19,28.82 ; 82.42,23.12 v1(82.67,23.38) 82.93,23.12 ; v1(80.02,19.56) 79.82,19.76 79.82,19.87 v1(79.56,19.62) ; 88.94,17.48 88.94,17.9 88.92,17.92 88.63,17.63 v1(88.63,17.26) ; 77.57,21.61 77.64,21.67 ; 77.57,21.61 v1(77.62,21.57) U1.M2 ; 77.57,21.61 77.51,21.67 ; 77.64,21.67 77.79,21.82 U1.M2 ; 77.64,21.67 77.51,21.67 ; v1(82.75,19.48) U1.T10 83.77,19.92 v1(83.77,19.98) 83.77,20.57 83.99,20.79 ; v1(84.09,20.89) U1.N12 ; 85.02,23.77 U1.K13 85.3,23.4 ; v1(83.91,23.38) 84.17,23.12 ; v1(83.91,23.38) U1.K11 ; v1(82.16,21.03) 82.28,21.03 82.42,21.17 ; 77.31,19.14 v1(77.56,18.88) ; 77.31,19.14 U1.T1 77.13,19.13 ; 85.16,19.37 85.02,19.22 ; 79.82,17.92 U1.U6 ; 79.82,17.92 79.81,17.81 ; 79.82,17.92 79.56,17.92 v1(79.31,18.18) ; v1(80.22,20.92) U1.N6 79.82,21.82 ; 85.55,23.4 85.3,23.4 ; U1.M2 U1.M3 v1(78.77,21.63) ; 80.12,29.08 79.87,29.33 77.58,29.33 U1.A1 77.34,28.97 v1(77.47,28.84) ; 80.12,29.08 80.12,28.67 U1.B6 v1(80.73,28.58) ; v1(87.25,28.69) 87.25,28.61 U1.B16 ; v1(88.66,26.77) 88.92,27.02 v1(89.17,26.77) ; 77.51,21.67 77.36,21.82 U1.M1 77.37,21.67 77.51,21.67 ; v1(87.36,18.96) U1.T17 ; v1(90.66,20.05) 90.41,20.05 U1.R21 ; U1.R21 90.73,20.38 90.73,21.96 U1.L21 90.22,22.73 90.34,22.85 v1(91.93,22.85) 93.85,22.85 C38.1 ; 79.81,17.81 v1(79.56,17.81) ; v1(81.49,19.22) U1.T8 81.77,19.11 v1(81.91,18.97) ; v1(86.03,24.42) 86.32,24.42 ; v1(81.49,23.54) 81.9,23.12
  Top Layer w0.254: 27.6,2.43 27.61,2.44 ; 27.6,2.43 27.73,2.3 27.73,2.05 ; 27.6,2.43 27.59,2.44 ; 27.6,2.43 27.47,2.3 ; 27.61,2.44 27.98,2.81 v1(27.98,3.83) ; 27.61,2.44 27.97,2.44 27.97,1.8 ; 27.61,2.44 27.59,2.44 ; 66.24,14.15 66.19,14.1 65.43,14.1 v1(65.18,13.85) ; 66.24,14.15 v1(65.37,14.15) 60.36,14.15 C65.1 ; 66.24,14.15 66.28,14.19 ; 66.24,14.15 66.9,14.15 66.94,14.19 ; 23.05,16.36 23.05,16.16 ; 23.05,16.36 11.3,16.36 ; 23.05,16.36 23.25,16.36 ; 23.05,16.16 C83.2 ; 23.05,16.16 22.71,15.82 ; 23.05,16.16 23.25,16.36 ; C83.2 23.28,15.95 23.28,15.97 23.53,15.71 v1(23.68,15.86) ; C83.2 23.05,14.93 18.52,14.93 ; C83.2 22.94,15.82 22.71,15.82 ; C16.2 63.08,8.67 ; C16.2 63.08,8.67 ; C16.2 62.8,6 62.8,6.16 v1(63.06,6.42) ; C16.2 59.84,5.72 ; C16.2 61.2,5.72 60.08,4.6 ; 63.08,8.67 C19.1 ; 63.08,8.67 C84.1 ; 79.05,8.14 77.1,8.14 U2.A3 77.1,7.53 71.57,7.53 C84.1 ; 79.05,8.14 81,8.14 ; 79.05,8.14 U2.D4 79.05,8.94 ; 80.94,21.82 82.42,21.82 ; 80.94,21.82 80.94,23.12 v1(81.46,23.12) U1.K8 U1.K10 U1.K11 U1.K12 ; 80.94,21.82 80.47,21.82 ; 82.42,21.82 84.37,21.82 84.37,21.5 ; 82.42,21.82 82.42,21.17 81.77,21.17 U1.T8 ; 66.28,14.19 U3.9 59.82,14.19 ; 66.28,14.19 66.94,14.19 ; 66.28,14.19 66.94,14.85 67.08,14.85 U3.21 ; 31.15,19.72 R28.2 ; 31.15,19.72 30.52,20.35 ; 31.15,19.72 30.13,18.71 30.13,18.2 ; R28.2 31.42,20.31 ; R28.2 v1(30.66,20.25) ; R28.2 31.52,19.39 C11.1 ; R28.2 31.42,16.36 ; 89.45,16.43 90.22,16.43 U1.V21 90.63,17.92 90.63,19.87 ; 89.45,16.43 88.92,16.43 88.92,17.92 ; 89.45,16.43 U2.Y12 89.45,14.54 88.8,14.54 ; U1.H11 83.72,24.17 ; 83.72,24.17 84.37,24.17 ; 83.72,24.17 83.07,24.17 U1.H10 ; v1(17.5,12.64) 15.41,12.64 C10.1 v1(17.76,12.38) 18.39,12.38 18.39,14.93 ; 49.08,5.52 46.01,5.52 ; 49.08,5.52 C81.2 ; 49.08,5.52 C2.1 ; 46.01,5.52 46.01,5.72 C31.2 ; 46.01,5.52 C81.2 ; 7.1,3.05 6.79,2.74 ; 7.1,3.05 7.1,3.06 7.12,3.06 ; 7.1,3.05 7.1,2.74 6.79,2.74 ; 7.1,3.05 7.12,3.06 ; 6.79,2.74 USB1.B1 6.45,2.56 6.71,2.31 6.71,1.8 ; 84.9,6.95 U2.N2 84.9,6.54 85.55,6.54 ; 84.9,6.95 82.95,6.95 ; 84.9,6.95 84.9,7.34 85.55,7.34 ; 6.71,1.8 7.21,1.29 7.21,1.04 7.98,0.28 9.5,0.28 10.01,0.78 10.01,1.8 9.07,2.74 8.61,2.74 ; 6.71,1.8 6.29,1.38 5.78,1.38 4.67,2.48 4.67,8.49 5.69,9.51 5.94,9.51 6.2,9.76 6.71,9.25 6.71,8.75 6.45,8.49 USB1.B12 USB1.A1 9.03,8.24 ; 83.07,29.37 U1.A10 ; 83.07,29.37 79.51,29.37 ; 83.07,29.37 88.27,29.37 ; 100.06,18.27 100.06,18.53 100.18,18.65 ; 100.06,18.27 100.03,18.27 ; 100.06,18.27 C44.1 ; 11.22,14.2 11.22,16.36 ; 11.22,14.2 11.22,13.95 ; 11.22,14.2 11.3,14.27 11.3,16.36 ; 11.22,14.2 10.79,13.76 ; 11.22,16.36 11.3,16.36 ; 11.22,16.36 11.22,17.67 ; 104.31,23.93 v1(104.38,23.86) ; 104.31,23.93 v1(104.05,23.93) C1.2 103.29,21.3 100.64,18.65 ; 104.31,23.93 114.65,23.93 ; 115.06,23.93 116.82,23.93 C12.1 ; 115.06,23.93 114.65,23.93 ; 115.06,23.93 115.06,19.92 ; 115.06,23.93 115.06,27.12 U10.2 114.65,23.93 ; U2.G10 81,13.74 82.3,13.74 ; v1(57.59,21.41) 58.38,21.41 58.4,21.39 ; v1(29.43,0.78) 28.93,1.29 U7.2 ; 88.92,24.42 88.92,24.1 90.63,24.1 90.63,22.47 ; C12.1 116.69,19.92 115.06,19.92 ; C12.1 116.69,20.17 v1(116.18,20.17) ; C12.1 116.82,19.37 114.52,19.37 ; C55.1 97.94,14.04 ; C55.1 98.84,14.77 ; C55.1 98.67,14.04 97.94,14.04 ; C55.1 98.76,14.86 ; 97.94,14.04 v1(97.91,14.01) ; 97.94,14.04 93.2,14.04 93.2,13.34 U2.AB10 90.75,13.74 88.8,13.74 U2.W11 88.8,14.54 ; 85.02,17.92 U1.U13 ; 85.02,17.92 85.55,17.92 U2.P12 85.55,14.54 ; 85.02,17.92 U1.V12 ; 88.8,14.54 88.15,14.54 ; C81.2 45.59,2.03 ; C81.2 49.15,2.45 49.15,1.72 ; C81.2 37.62,2.45 ; 45.59,2.03 45.54,1.98 ; 45.59,2.03 45.59,1.98 45.54,1.98 ; 11.22,13.95 11.04,13.76 ; 11.22,13.95 11.22,13.76 ; 11.22,13.95 v1(11.3,14.02) ; 11.04,13.76 11.22,13.76 ; 11.04,13.76 10.79,13.76 ; 37.62,1.94 38.39,1.94 38.59,1.73 ; 37.62,1.94 37.58,1.94 36.87,1.22 ; 37.62,1.94 37.62,2.45 ; 36.87,1.22 36.95,1.22 ; 36.87,1.22 36.41,1.22 ; 36.87,1.22 36.71,1.07 ; 88.8,6.54 U2.W2 88.8,7.34 90.75,7.34 U2.AB3 ; 88.8,6.54 89.45,6.54 U2.Y1 ; 88.8,6.54 88.15,6.54 ; 85.67,23.77 85.02,23.77 U1.J13 U1.H13 ; 85.67,23.77 U1.J14 U1.H14 ; 85.67,23.77 86.32,23.77 86.32,24.42 ; 7.35,3.3 7.35,3.22 7.27,3.22 ; 7.35,3.3 7.35,7.85 ; 7.35,3.3 7.27,3.22 ; 7.35,3.3 7.47,3.41 7.47,7.73 7.35,7.85 ; 82.3,6.54 81,6.54 81,6.54 ; 82.3,6.54 82.95,6.54 U2.K2 82.95,6.95 ; 82.3,6.54 82.3,6.14 ; C11.1 31.42,16.36 ; C11.1 31.72,16.17 v1(31.72,15.66) ; C11.1 31.52,16.29 31.4,16.17 v1(31.4,15.66) ; 31.42,16.36 23.25,16.36 ; R5.1 49.65,0.97 v1(49.91,1.22) ; R5.1 49.26,0.85 v1(49.92,0.85) ; R5.1 49.15,1.72 ; 100.03,18.27 100.03,18.65 100.18,18.65 ; 100.03,18.27 C44.1 ; 100.03,18.27 99.8,18.27 99.55,18.02 99.55,17.26 99.04,16.75 99.04,15.78 ; 122.09,14.87 v1(137.28,14.87) v1(137.79,14.87) ; 122.09,14.87 122.09,3.57 ; 122.09,14.87 113.54,14.87 v1(113.54,15.35) v1(113.54,16.62) C82.1 ; C39.1 11.22,21.64 11.22,22.37 ; C39.1 C40.1 ; C39.1 11.22,22.37 ; 88.8,8.94 89.45,8.94 ; 88.8,8.94 88.15,8.94 ; 88.8,8.94 U2.W4 ; 79.7,8.94 U2.E5 ; 79.7,8.94 79.05,8.94 ; 79.7,8.94 81,8.94 U2.G5 ; U2.V12 88.15,14.54 ; 86.85,8.94 84.9,8.94 U2.N4 84.9,8.14 85.55,8.14 U2.P3 85.55,7.34 ; 86.85,8.94 88.15,8.94 ; 86.85,8.94 U2.T5 ; v1(99.3,13.96) 99.04,14.21 99.04,14.77 ; 63.16,21.92 63.16,23.26 ; 63.16,21.92 71.59,21.92 C71.1 ; 63.16,21.92 63.16,21.35 C15.1 58.4,21.39 ; 63.16,23.26 v1(63.23,23.26) ; 63.16,23.26 62.72,23.26 62.72,23.41 C54.1 ; 63.16,23.26 C54.1 ; 29.21,1.76 U7.2 ; 29.21,1.76 32.78,1.76 ; 29.21,1.76 28.74,1.76 ; 29.21,1.76 29.25,1.8 32.75,1.8 32.78,1.76 ; U7.2 28.27,1.76 ; U7.2 28.49,1.29 28.02,1.76 ; U7.2 28.74,1.76 ; 36.71,8.98 36.73,8.96 v1(36.73,8.26) 36.73,5.98 ; 36.71,8.98 36.71,8.68 ; 36.71,8.98 36.71,10.32 ; 79.05,12.14 U2.D9 ; 79.05,12.14 79.7,12.14 ; 79.05,12.14 78.4,12.14 U2.C8 ; 84.37,24.17 U1.J12 U1.K12 ; 84.37,24.17 U1.H12 U1.H13 ; C17.1 37.88,25 ; C17.1 37.47,24.72 ; C17.1 38.48,25.32 v1(41.24,25.32) ; C17.1 37.85,24.97 37.88,25 ; 37.88,25 37.88,25.62 U4.2 ; 37.88,25 38.36,25.48 v1(38.61,25.48) ; C56.1 106.8,15.36 100.03,15.36 ; C56.1 106.58,14.86 100.03,14.86 ; C56.1 v1(105.57,14.64) ; 5.93,27.29 4.65,27.29 ; 5.93,27.29 5.93,26.27 C41.1 ; 5.93,27.29 9.48,27.29 C41.1 ; 5.93,27.29 5.93,27.3 3.85,27.3 C37.1 ; 4.65,27.29 3.94,26.57 C37.1 ; 4.65,27.29 4.56,27.29 C37.1 ; 66.94,14.19 U3.21 ; 66.94,14.19 67.34,14.19 U3.21 ; U2.C5 78.4,8.94 79.05,8.94 ; 23.21,20.35 30.52,20.35 ; 23.21,20.35 23.21,23.43 ; 23.21,20.35 C13.2 ; 30.52,20.35 31.42,20.35 31.42,20.31 ; 30.52,20.35 v1(30.39,20.48) ; 27.59,2.44 27.46,2.3 ; 27.59,2.44 U7.4 ; 27.46,2.3 27.28,2.3 U7.4 ; 27.46,2.3 27.47,2.3 ; 27.46,2.3 27.34,2.18 U7.4 ; 36.41,1.22 36.41,2.45 37.62,2.45 ; 36.41,1.22 36.19,1.22 36.04,1.07 ; 36.41,1.22 36.41,1.07 ; 23.25,16.36 23.72,16.83 23.72,18.44 ; v1(52.21,16.02) 51.7,15.51 ; 51.7,15.51 57.93,15.51 ; 51.7,15.51 C76.1 49.26,15.51 C64.1 49.26,12.1 ; 90.63,22.47 U1.L21 ; 90.63,22.47 92.11,22.47 ; 79.82,15.34 79.82,17.92 80.47,17.92 U1.U6 ; 79.82,15.34 79.7,15.34 U2.E12 79.7,14.54 79.05,14.54 U2.D11 79.05,13.74 78.09,13.74 ; 79.82,15.34 81,15.34 U2.G12 81,14.54 82.3,14.54 ; 88.8,12.14 U2.W9 ; 88.8,12.14 89.45,12.14 ; 88.8,12.14 88.15,12.14 ; 78.09,13.74 77.1,13.74 U2.A10 ; 78.09,13.74 78.09,14.94 ; 11.22,13.76 v1(11.55,13.76) ; C60.1 32.78,1.76 ; C60.1 33.47,0.89 33.65,0.71 35.68,0.71 36.04,1.07 ; C60.1 33.47,1.76 32.78,1.76 ; C60.1 36.04,1.07 ; 49.29,5.72 C2.1 ; 49.29,5.72 49.48,5.72 ; 49.29,5.72 49.3,5.82 v1(49.55,6.08) ; 49.29,5.72 49.28,5.72 C2.1 ; C2.1 49.48,5.72 ; 49.26,12.1 49.26,10.32 36.71,10.32 ; 49.26,12.1 v1(48.65,12.1) ; v1(137.79,14.87) C62.1 ; v1(137.79,14.87) 137.79,4.45 C63.1 ; 80.47,21.82 U1.N6 ; 80.47,21.82 79.51,21.82 ; C41.1 10.59,26.22 11.22,26.22 ; C41.1 11.22,26.27 11.22,26.22 ; C41.1 11.22,25.55 ; 100.18,18.65 100.64,18.65 ; 100.18,18.65 100.57,19.04 100.57,20.05 v1(101.07,20.56) ; 100.64,18.65 C44.1 ; 100.64,18.65 C82.1 ; C28.1 18.39,15.56 ; 18.39,15.56 18.39,14.93 ; 18.39,15.56 18.52,15.43 18.52,14.93 ; 18.39,15.56 19.15,16.32 21.95,16.32 22.45,15.82 22.71,15.82 ; 86.32,25.72 U1.F14 U1.G14 ; 57.93,15.51 59.82,15.51 59.82,14.19 ; 57.93,15.51 C65.1 ; 36.71,1.07 36.8,1.07 36.95,1.22 ; 36.71,1.07 36.41,1.07 ; 100.03,14.86 100.03,15.36 ; 100.03,14.86 100.03,14.77 99.04,14.77 ; 100.03,14.86 99.04,14.86 ; 79.05,6.54 79.7,6.54 ; 79.05,6.54 U2.D2 ; 79.05,6.54 78.4,6.54 U2.C1 78.4,1.68 C57.1 78.37,1.48 78.37,1.37 78.62,1.37 79.13,0.86 79.89,0.86 80.15,1.12 v1(81.67,1.12) ; 85.55,7.34 86.85,7.34 U2.T3 ; 18.39,14.93 18.52,14.93 ; 82.3,8.14 82.95,8.14 U2.K4 ; 82.3,8.14 81,8.14 ; 82.3,8.14 82.3,7.34 82.95,7.34 82.95,6.95 ; 79.51,29.37 77.22,29.37 U1.A1 ; 79.51,29.37 79.51,21.82 ; 100.03,15.36 100.03,16.77 ; 86.85,6.54 U2.T1 86.85,2.28 87.69,2.28 C34.1 ; 86.85,6.54 86.85,6.54 85.55,6.54 ; 86.85,6.54 88.15,6.54 ; 36.73,5.98 36.98,6.23 v1(37.31,6.23) ; 36.73,5.98 C31.2 ; 49.48,5.72 C24.1 ; 99.04,14.86 99.04,14.77 ; 99.04,14.86 99.04,14.97 ; 99.04,14.86 98.93,14.86 ; 99.04,14.77 98.84,14.77 ; 89.45,8.94 U2.Y5 ; 89.45,8.94 90.75,8.94 U2.AB5 ; 88.15,8.94 U2.V5 U2.V8 88.15,12.14 ; U2.K9 82.95,12.94 82.3,12.94 82.3,13.74 ; U2.K9 U2.N9 ; U2.K9 82.95,12.14 81,12.14 ; C85.1 53.28,1.57 v1(53.11,1.57) ; C85.1 53.79,1.72 49.15,1.72 ; C85.1 54,0.85 v1(54.49,0.85) ; 36.41,1.07 36.04,1.07 ; 74.21,21.2 77.22,21.2 77.22,21.57 ; 74.21,21.2 C71.1 ; 74.21,21.2 74.21,19.22 76.84,19.22 ; 88.27,29.37 90.22,29.37 U1.A21 90.63,28.97 90.63,27.35 88.92,27.35 88.92,27.02 ; 88.27,29.37 U1.A18 ; C40.1 11.22,18.4 11.22,17.67 ; C40.1 11.22,17.67 ; C40.1 10.5,18.34 9.73,17.57 9.73,16.56 10.5,15.8 C14.1 ; 98.76,14.86 98.93,14.86 ; 98.76,14.86 98.76,15.5 99.04,15.78 ; 98.93,14.86 99.04,14.97 ; 98.93,14.86 98.84,14.77 ; 38.59,1.73 45.08,1.73 v1(45.34,1.98) 45.54,1.98 ; 38.59,1.73 38.64,1.68 v1(45.24,1.68) 45.54,1.98 ; 38.59,1.73 37.46,1.73 36.95,1.22 ; 11.22,26.22 11.22,25.55 ; 11.22,26.22 11.35,26.22 12.11,25.46 16.43,25.46 v1(16.94,24.95) ; 82.3,14.54 82.95,14.54 U2.K11 82.95,13.74 82.3,13.74 ; 82.3,14.54 82.3,14.94 ; U2.N9 84.9,12.94 85.55,12.94 U2.P10 85.55,13.74 ; U2.N9 84.9,12.14 86.85,12.14 ; C24.1 54.79,5.72 ; C24.1 53.96,5.57 54.63,5.57 54.79,5.72 ; 54.79,5.72 58.44,5.72 ; 54.79,5.72 v1(55.4,6.33) ; 79.7,12.14 U2.E8 ; 79.7,12.14 81,12.14 ; 28.02,1.76 27.97,1.76 27.97,1.8 ; 28.02,1.76 28.27,1.76 ; 28.02,1.76 27.98,1.8 ; 11.22,22.37 11.22,25.55 ; 11.22,22.37 11.26,22.4 11.26,25.51 11.22,25.55 ; v1(109.24,4.07) 109.82,4.07 C49.1 110.08,3.57 122.09,3.57 ; v1(58.4,22.83) 58.4,21.39 ; 122.09,3.57 137.9,3.57 ; 137.9,3.57 C63.1 ; 137.9,3.57 138.68,3.57 ; 23.72,19.63 23.72,19.67 C13.2 ; 23.72,19.63 23.72,18.44 ; 23.72,19.63 23.93,19.42 23.93,18.65 23.72,18.44 ; 23.72,19.63 23.17,20.18 C13.2 ; 11.22,17.67 11.3,17.6 11.3,16.36 ; 78.09,14.94 U2.C12 ; 78.09,14.94 78.09,15.34 77.22,15.34 U1.V1 76.84,17.92 76.84,19.22 ; 85.55,6.54 U2.P1 ; C61.1 60.08,4.6 60.08,4.6 ; C61.1 60.08,4.6 ; C61.1 58.44,5.72 ; C61.1 59.82,5.1 ; 88.15,6.54 U2.V1 ; C31.2 36.71,5.72 36.71,8.68 ; C31.2 37.62,4.83 37.62,2.45 ; U2.T10 86.85,13.74 85.55,13.74 ; 86.85,12.14 88.15,12.14 ; 86.85,12.14 U2.T8 ; 138.68,3.57 140.04,3.57 ; 138.68,3.57 C63.1 ; 138.68,3.57 140.44,1.8 141.71,1.8 142.47,1.04 C5.1 ; 140.04,3.57 142.54,3.57 C5.1 ; 140.04,3.57 139.26,4.34 C63.1 ; 140.04,3.57 C5.1 ; 30.13,18.2 30.13,18.2 ; 30.13,18.2 30.38,18.2 v1(31.4,17.18) ; 28.27,1.76 28.74,1.76 ; 28.27,1.76 28.23,1.8 27.98,1.8 ; 81,6.54 79.7,6.54 ; 81,6.54 U2.G1 ; 85.55,13.74 84.9,13.74 U2.N11 84.9,14.54 85.55,14.54 ; 76.84,19.22 U1.T1 ; C82.1 113.54,19.37 114.52,19.37 ; C82.1 113.8,18.65 114.52,19.37 ; 27.98,1.8 27.97,1.8 ; C54.1 62.43,23.84 62.43,25.62 U4.2 ; v1(23.43,17.13) 23.43,18.15 23.72,18.44 ; C71.1 72.1,20.69 v1(72.36,20.94) ; C4.1 31.38,10.49 v1(30.87,10.49) ; C4.1 31.43,10.23 v1(30.62,10.23) ; C4.1 36.71,10.32 ; 100.03,16.77 C44.1 ; 100.03,16.77 99.04,15.78 ; 87.62,21.17 87.45,21.17 87.45,23.12 U1.K14 U1.K13 U1.K12 ; 87.62,21.17 U1.N18 ; 87.62,21.17 U1.T17 ; 18.52,14.93 v1(18.52,14.16) v1(18.52,13.65) ; 59.82,14.19 C65.1 ; 79.7,6.54 U2.E1 ; U1.M2 77.87,21.57 ; 77.87,21.57 77.22,21.57 ; 77.87,21.57 78.52,21.57 U1.M3 79.51,21.82 ; 7.21,3.16 7.12,3.06 ; 7.21,3.16 7.21,3.06 ; 7.21,3.16 7.27,3.22 ; 7.21,3.16 7.21,3.22 7.27,3.22 ; 7.12,3.06 7.21,3.06 ; 92.11,22.47 94,22.47 C38.1 ; 92.11,22.47 92.11,19.87 90.63,19.87 ; 58.44,5.72 59.82,5.72 ; 59.82,5.72 59.84,5.72 ; 59.82,5.72 59.82,5.7 ; 99.04,15.78 99.04,14.97 ; C18.1 23.21,23.59 23.21,23.43 ; C18.1 23.21,23.43 ; C18.1 C13.2 ; C84.1 71.28,8.96 v1(64.37,8.96) v1(63.82,8.96) C19.1 ; 27.97,1.8 27.73,2.05 ; 60.08,4.6 60.08,4.85 59.82,5.1 ; 23.21,23.43 23.52,23.12 v1(23.77,23.12) ; U2.G8 81,12.14 ; 7.21,3.06 7.5,3.06 7.5,2.74 USB1.A12 8.61,2.74 ; 7.35,7.85 6.96,8.24 ; 7.35,7.85 7.35,8.24 6.96,8.24 ; 85.55,14.54 86.85,14.54 ; 89.45,12.14 90.75,12.14 U2.AB8 ; 89.45,12.14 U2.Y8 ; 9.03,8.24 9.8,7.48 9.8,3.92 8.61,2.74 ; 9.03,8.24 9.99,9.19 9.99,11.22 9.73,11.48 9.73,13 C14.1 ; 36.71,8.68 v1(36.29,8.26) ; C14.1 10.79,13.76 ; C14.1 6.81,13.76 6.81,8.24 6.96,8.24 ; C63.1 v1(137.9,6.78) ; 81,8.14 U2.G3 ; 37.47,24.72 37.47,27.85 C73.1 ; 37.47,24.72 37.07,24.72 37.07,20.31 31.42,20.31 ; 84.37,21.5 86.32,21.5 86.32,21.17 ; 84.37,21.5 U1.N12 83.99,21.17 83.99,20.12 83.07,20.12 U1.T10 ; v1(26.8,27.7) 26.23,27.7 C73.1 ; U1.M1 77.22,21.57 ; U4.2 56.88,26.03 v1(57.13,26.03) ; C73.1 26.16,27.93 v1(27.01,27.93) ; 27.73,2.05 27.47,2.3 ; U1.H13 U1.G13 U1.G14 ; 114.52,19.37 115.06,19.92 ; 90.63,19.87 U1.R21 ; U1.G14 86.32,25.07 ; 88.15,14.54 86.85,14.54 ; C19.1 59.84,5.72 ; U2.T12 86.85,14.54 ; 59.82,5.1 59.82,5.7 ; 59.84,5.72 59.82,5.7 ; C65.1 v1(60.59,13.62)
  GND w0.225: 89.05,15.06 89.31,15.06 v1(89.68,14.69) ; 89.05,15.06 89.05,15.31 88.63,15.73 v1(88.63,17.26) ; 89.05,15.06 88.55,14.55 v1(88.55,14.39) ; 86.77,7.31 87.28,6.8 87.53,6.8 87.79,6.55 88.69,6.55 90.21,8.07 90.21,8.32 89.7,8.83 v1(89.7,9.09) ; 86.77,7.31 v1(86.59,7.31) ; 86.77,7.31 86.85,7.31
  GND w0.232: v1(85.3,23.52) 85.04,23.52 84.68,23.88 84.42,23.88 ; v1(84.62,24.19) 84.37,23.94 84.42,23.88 ; 77.7,21.57 77.95,21.82 78.58,21.82 v1(78.77,21.63) 78.77,21.37 78.52,21.12 v1(78.86,20.78) ; 77.7,21.57 77.87,21.57 ; 77.7,21.57 v1(77.62,21.57) ; v1(79.56,17.81) 79.56,18.06 79.31,18.31 ; 79.06,19.11 v1(79.56,19.62) 80.07,19.62 80.58,19.11 81.09,19.11 81.27,19.29 81.41,19.29 v1(81.49,19.22) 83.01,19.22 v1(83.77,19.98) ; 79.06,19.11 v1(78.8,19.11) ; 79.06,19.11 79.06,18.68 79.31,18.43 79.31,18.31 ; 84.42,23.88 v1(83.91,23.38) ; 79.31,18.31 79.05,18.57 79.05,18.83 v1(78.91,18.83) ; 79.31,18.31 v1(79.31,18.18) ; v1(84.79,25.32) 84.53,25.06 83.77,25.06 82.25,23.54 v1(81.49,23.54)
  GND w0.254: v1(104.38,23.86) v1(101.07,20.56) ; v1(116.18,20.17) 115.93,19.92 115.93,19 v1(113.54,16.62) 113.54,15.86 v1(114.03,15.37) ; v1(52.21,16.02) 52.21,16.47 51.45,17.23 51.45,20.28 v1(50.18,21.55) ; v1(36.29,8.26) 36.8,7.75 36.8,6.74 v1(37.31,6.23) ; v1(23.43,17.13) 23.43,16.11 v1(23.68,15.86)
  Inner2 w0.225: 82.77,13.3 82.95,13.48 82.95,13.99 v1(82.55,14.39) 82.44,14.5 81.42,14.5 81.42,14.51 v1(81.17,14.51) ; 82.77,13.3 82.73,13.34 82.48,13.34 82.41,13.27 ; 82.77,13.3 v1(83.24,12.83) ; 82.77,13.3 82.73,13.27 82.41,13.27 ; 91.68,10.91 v1(91.17,11.42) ; 91.68,10.91 90.75,9.98 ; 91.68,10.91 92.69,11.92 92.95,11.92 94.98,13.96 v1(99.3,13.96) ; 85.12,13.34 85.37,13.09 85.37,13.42 v1(85.62,13.67) ; 85.12,13.34 84.61,12.83 v1(84.61,12.32) ; 85.12,13.34 84.91,13.55 84.91,14.31 85.16,14.31 v1(85.41,14.57) ; v1(76.84,13.71) 76.84,18.28 77.39,18.83 77.65,18.83 77.9,18.57 78.41,18.57 78.66,18.83 v1(78.91,18.83) ; 90.57,8.63 90.62,8.58 90.62,7.82 v1(90.95,7.49) ; 90.57,8.63 87.69,5.75 87.69,5.07 ; 90.57,8.63 90.11,9.09 89.85,9.09 ; 90.57,8.63 v1(90.97,9.03) ; 82.22,13.27 82.22,13.09 82.41,13.27 ; 82.22,13.27 v1(81.72,13.77) ; 82.22,13.27 82.41,13.27 ; v1(90.15,17.51) 89.9,17.26 v1(88.63,17.26) ; 90.75,9.98 v1(91.26,9.98) ; 90.75,9.98 89.85,9.09 ; 87.69,5.07 v1(87.69,3.98) ; 87.69,5.07 87.4,4.78 86.39,4.78 84.86,3.25 84.36,3.76 84.36,4.78 85.37,5.8 84.86,6.3 84.61,6.3 84.36,6.05 84.1,6.05 v1(82.83,7.32) 82.32,6.81 82.32,6.56 82.07,6.3 v1(81.31,6.3) ; 87.69,5.07 v1(88.17,5.54) ; 89.85,9.09 v1(89.7,9.09) ; v1(81.67,1.12) 81.67,1.37 80.72,2.33 80.72,5.12 v1(79.95,5.89) ; v1(71.15,7.27) 71.65,6.76 71.65,6.25 72.16,5.74 74.19,5.74 v1(74.45,5.49)
  Inner2 w0.232: 82.6,19.43 82.6,19.33 ; 82.6,19.43 82.6,19.55 82.35,19.8 82.46,19.8 82.72,19.55 82.6,19.43 ; 82.6,19.43 82.46,19.29 82.46,19.22 82.28,19.04 ; 82.6,19.33 82.31,19.04 ; 82.6,19.33 v1(82.75,19.48) ; 82.6,19.33 82.6,19.29 82.35,19.04 82.31,19.04 ; 81.59,18.14 81.26,17.81 ; 81.59,18.14 81.59,18.06 81.34,17.81 81.26,17.81 ; 81.59,18.14 81.66,18.21 81.66,18.38 ; 81.59,18.14 81.59,18.32 81.66,18.38 ; 81.26,17.81 80.02,17.81 ; 81.26,17.81 81.15,17.7 80.13,17.7 80.02,17.81 ; v1(88.05,28.72) 88.05,28.97 88.02,28.94 88.02,28.69 ; 80.02,17.81 v1(79.56,17.81) ; 80.02,17.81 79.12,18.71 78.86,18.71 78.86,18.91 79.37,19.42 ; 77.44,28.87 77.54,28.97 v1(78.3,28.97) ; 77.44,28.87 v1(77.47,28.84) ; 77.44,28.87 77.29,28.72 77.29,29.02 ; 77.44,28.87 77.29,29.02 ; 77.29,29.02 77.29,29.16 77.22,29.09 77.29,29.02 ; v1(88.63,17.26) 88.12,17.77 87.87,17.77 87.36,18.27 v1(87.36,18.96) ; 86.18,17.61 86.43,17.87 86.43,18.88 86.23,19.08 ; 86.18,17.61 86.18,15.58 85.92,15.33 85.92,15.07 v1(85.41,14.57) ; 86.18,17.61 84.91,17.61 v1(84.65,17.36) ; 81.99,18.97 81.99,19 82.24,19 82.28,19.04 ; 81.99,18.97 81.99,18.71 81.66,18.38 ; 81.99,18.97 82.24,18.97 82.31,19.04 ; 82.31,19.04 82.28,19.04 ; 79.88,19.7 79.88,19.68 79.62,19.68 79.37,19.42 ; 79.88,19.7 79.88,19.81 79.76,19.81 ; 79.88,19.7 79.76,19.81 ; 79.88,19.7 v1(80.02,19.56) ; 79.76,19.81 79.62,19.81 ; 82.28,19.04 82.09,19.04 81.91,19.22 v1(81.91,18.97) 81.91,18.71 81.66,18.46 81.66,18.38 ; 86.23,19.39 86.23,19.14 ; 86.23,19.14 86.23,19.08 ; 86.23,19.14 86.18,19.14 86.23,19.08 ; 79.37,19.42 79.37,19.68 78.86,20.18 v1(78.86,20.78) ; 86.23,19.08 86.23,19.05 v1(85.98,18.8) ; 88.02,28.69 88.02,28.43 88.92,27.53 88.92,27.28 88.66,27.02 v1(88.66,26.77) ; 88.02,28.69 v1(87.25,28.69) 86.75,28.18 86.49,28.43 85.98,28.43 85.47,28.94 83.44,28.94 v1(83.41,28.97)
  Inner2 w0.254: v1(49.91,1.22) 45.84,1.22 45.34,1.73 v1(45.34,1.98)
  Inner3 w0.225: v1(81.27,9.09) 81.27,9.34 81.46,9.53 81.46,10.04 ; v1(90.15,17.51) 90.66,18.02 91.68,17 94.47,17 97.52,13.96 v1(99.3,13.96) ; 81.46,10.04 80.45,11.05 ; 81.46,10.04 82.48,10.04 83.24,10.8 v1(84,10.8) ; 80.45,11.05 80.7,11.31 v1(80.7,11.7) ; 80.45,11.05 80.19,11.31 80.19,11.4 79.43,12.16 v1(79.18,12.16) ; 85.72,8.92 v1(85.21,8.41) ; 85.72,8.92 86.82,8.92 ; 85.72,8.92 85.55,8.92 85.39,9.09 v1(87.16,9.09) ; v1(81.31,6.3) 80.46,6.3 80.04,5.89 v1(79.95,5.89) ; v1(88.29,14.65) v1(87.02,14.65) ; v1(81.17,14.51) 81.17,14.77 80.92,15.02 80.66,15.02 80.41,15.28 79.9,15.28 v1(79.9,15.14)
  Inner3 w0.232: 85.92,24.54 v1(86.03,24.42) ; 85.92,24.54 84.8,24.54 85.02,24.76 v1(85.27,24.76) ; 85.92,24.54 85.92,24.03 85.8,24.03 v1(85.3,23.52) ; 90.41,20.31 90.41,21.32 v1(91.93,22.85) ; 90.41,20.31 89.64,20.31 v1(88.52,21.43) ; 90.41,20.31 v1(90.66,20.05) ; 90.22,28.77 90.05,28.94 87.51,28.94 v1(87.25,28.69) ; 90.22,28.77 90.3,28.69 ; 90.22,28.77 89.97,28.77 ; v1(83.91,23.38) 83.91,23.12 83.94,23.09 83.69,23.09 83.69,22.87 83.44,23.12 82.93,23.12 v1(82.67,23.38)
  Inner3 w0.254: v1(17.76,12.38) v1(17.5,12.64) 16.38,13.76 v1(11.55,13.76) v1(11.3,14.02) ; U10.2 114.66,21.7 v1(116.18,20.17) ; v1(48.65,12.1) 48.91,12.36 48.91,12.72 v1(52.21,16.02) ; v1(31.4,15.66) v1(31.4,17.18)
  Inner4 w0.225: v1(79.34,8.83) 79.6,9.09 79.6,9.19 ; 86.85,14.82 86.85,14.57 87.36,14.06 87.36,13.8 87.31,13.8 87.31,13.55 87.06,13.55 86.8,13.3 v1(86.8,13.04) ; 86.85,14.82 v1(87.02,14.65) v1(88.29,14.65) v1(88.55,14.39) ; 86.85,14.82 86.34,14.82 86.09,14.57 v1(85.41,14.57) ; 86.85,14.82 v1(87.1,15.07) ; 79.6,9.19 79.7,9.19 79.8,9.09 v1(81.27,9.09) ; 79.6,9.19 79.44,9.19 79.6,9.34 79.6,9.19 ; v1(88.17,5.54) 90.34,5.54 90.59,5.8 91.61,5.8 91.86,5.54 92.11,5.54 92.37,5.8 92.37,6.56 v1(94.65,8.84) ; v1(87.36,10.72) 87.7,11.06 87.7,11.23 88.21,11.74 88.32,11.63 v1(88.32,11.37) 88.06,11.12 88.06,9.99 v1(87.16,9.09) ; v1(90.98,13.11) 91,13.11 91,12.6 90.75,12.34 90.75,11.84 v1(91.17,11.42) ; v1(84.61,12.32) 84.1,12.83 v1(83.24,12.83) 83.24,12.58 83.75,12.07 83.75,11.05 v1(84,10.8) ; v1(79.95,5.89) 79.19,6.65 v1(78.8,6.65) ; 90.29,17.99 90.41,17.99 ; 90.29,17.99 90.15,17.99 ; 90.29,17.99 v1(90.29,17.23) ; 90.15,17.99 v1(90.15,17.51) ; 90.15,17.99 90.15,18.02
  Inner4 w0.232: v1(84.79,25.32) 86.56,25.32 88.09,26.84 89.1,26.84 v1(89.17,26.77) ; 83.07,19.76 83.07,19.87 ; 83.07,19.76 83.07,19.54 ; 83.07,19.76 83.61,19.76 83.61,19.98 83.86,19.98 84.37,20.49 84.88,20.49 85.39,19.98 85.39,19.48 ; 83.07,19.76 82.85,19.76 83.07,19.54 ; 83.07,19.87 82.16,20.78 v1(82.16,21.03) ; 83.07,19.87 v1(84.09,20.89) ; 85.39,19.48 85.02,19.11 v1(85.02,18.85) ; 85.39,19.48 85.47,19.56 ; 85.47,19.56 85.98,19.05 v1(85.98,18.8) ; 85.47,19.56 85.73,19.56 86.57,20.41 v1(86.57,20.92) ; v1(81.46,23.12) 81.97,23.12 82.22,23.38 v1(82.67,23.38) ; 83.07,19.54 82.75,19.54 ; 82.75,19.54 82.75,19.22 ; 82.75,19.54 82.56,19.54 ; v1(88.66,26.77) 88.66,26.71 88.92,26.71 88.92,24.93 v1(89.17,24.68)
  Inner4 w0.254: v1(63.06,6.42) 62.8,6.67 62.8,7.94 v1(63.82,8.96) ; v1(11.55,13.76) 16.38,13.76 v1(17.5,12.64) v1(18.52,13.65) ; v1(29.43,0.78) 29.43,1.4 v1(36.29,8.26) ; 49.42,21.04 v1(45.86,21.04) 45.77,20.95 v1(45.52,20.95) ; 49.42,21.04 v1(49.67,21.3) ; 49.42,21.04 49.67,21.04 v1(50.18,21.55) ; v1(60.59,13.62) 60.61,13.6 60.86,13.85 v1(65.18,13.85)
  Bottom Layer w0.2: 66.39,9.7 66.39,8.99
  Bottom Layer w0.225: v1(78.63,14.63) 78.88,14.63 79.65,15.4 v1(79.9,15.14) ; v1(78.8,6.65) 78.8,6.14 78.4,5.74 76.99,5.74 75.97,6.76 75.21,6.76 74.96,6.51 74.96,6 v1(74.45,5.49) ; v1(79.34,8.83) 79.09,9.09 v1(78.15,9.09) ; C26.2 82.18,1.63 v1(81.67,1.12) ; v1(90.97,9.03) 91.22,9.03 91.48,8.77 ; v1(89.7,9.09) v1(87.16,9.09)
  Bottom Layer w0.232: 81.49,21.28 81.66,21.28 81.91,21.03 v1(82.16,21.03) ; 81.49,21.28 81.4,21.28 ; 81.49,21.28 v1(81.49,23.54) ; 81.49,21.28 v1(81.49,19.22) ; v1(85.92,25.44) 85.92,25.18 85.78,25.04 85.78,24.68 v1(86.03,24.42) 86.8,24.42 87.31,24.93 87.56,24.93 87.81,24.68 v1(89.17,24.68) ; v1(80.22,20.92) 80.58,21.28 81.4,21.28 ; v1(90.66,20.05) 90.66,19.29 90.91,19.04 90.91,18.53 90.15,17.77 v1(90.15,17.51) ; v1(83.41,28.97) 83.16,28.97 82.65,28.46 81.35,28.46 81.24,28.58 v1(80.73,28.58) 78.7,28.58 v1(78.3,28.97) ; 81.4,21.28 81.4,21.79 81.15,22.05 81.15,22.81 v1(81.46,23.12) ; 77.56,18.71 v1(77.56,18.88) 77.56,19.22 77.73,19.05 77.73,18.8 77.98,18.55 78.49,18.55 79.51,19.56 v1(80.02,19.56) ; v1(79.56,19.62) v1(78.8,20.38)
  Bottom Layer w0.254: C51.1 22.23,1.8 22.23,1.8 ; C51.1 22.96,1.8 ; C51.1 22.23,1.8 ; 36.46,12.51 36.71,12.76 ; 36.46,12.51 34.7,14.27 34.7,15.4 ; 36.46,12.51 36.71,12.26 ; 36.71,12.76 36.71,14.8 38.75,14.8 ; 36.71,12.76 38.75,14.8 ; 36.71,12.76 36.71,12.26 ; 57.13,26.38 57.13,26.13 ; 57.13,26.13 v1(57.13,26.03) ; 57.13,26.13 57.27,25.99 ; v1(23.77,23.12) 23.52,23.12 23.42,23.22 ; 39.25,15.3 39.26,15.3 ; 39.25,15.3 C7.1 ; 39.25,15.3 39.26,15.3 ; 39.25,15.3 38.75,14.8 ; 39.26,15.3 40.7,15.3 42.47,13.53 ; 39.26,15.3 C7.1 ; 39.26,15.3 39.26,15.3 ; 63.74,23.22 63.74,23.14 63.82,23.14 ; 63.74,23.22 63.74,23.26 63.7,23.26 ; 63.74,23.22 63.82,23.14 ; 63.74,23.22 63.7,23.26 ; 147.58,7.39 147.58,7.58 ; 147.58,7.39 C48.1 ; 147.58,7.39 147.6,7.41 C47.1 ; 147.58,7.58 C47.1 ; 147.58,7.58 147.58,7.6 ; 139.73,11.48 U9.2 ; 139.73,11.48 139.73,11.19 141.63,11.19 ; 139.73,11.48 139.44,11.48 ; U9.2 139.44,11.48 ; U9.2 139.73,12.18 ; 117.07,13.85 123.17,13.85 ; 117.07,13.85 114.79,13.85 CARD1.13 ; 117.07,13.85 116.57,14.36 CARD1.13 ; 123.17,13.85 123.42,13.85 123.93,14.36 ; 123.17,13.85 123.68,14.36 123.93,14.36 ; C20.1 42.51,10.25 C74.1 ; C20.1 42.49,13.48 ; C20.1 42.75,10.23 42.75,8.25 ; 59.84,6.2 60.64,5.4 60.82,5.4 ; 59.84,6.2 59.84,7.6 ; 59.84,6.2 59.84,4.43 ; 59.84,6.2 C32.2 ; R13.2 96.94,9.86 96.94,9.35 ; R13.2 97.91,10.83 ; R13.2 97.19,9.35 ; 128.31,14.3 128.31,14.28 ; 128.31,14.3 128.82,14.3 CARD1.10 ; 128.31,14.3 124.89,14.3 124.38,14.8 ; 128.31,14.3 128.31,14.36 ; 128.31,14.28 124.38,14.28 124.38,14.8 ; 128.31,14.28 128.88,14.28 CARD1.11 ; 114.28,4.76 117.3,4.76 117.3,3.57 128.88,3.57 CARD1.11 ; 114.28,4.76 114.28,5.66 ; 114.28,4.76 CARD1.12 ; R17.1 87.69,3.82 v1(87.69,3.98) 85.16,1.44 ; R17.1 90.07,0.9 83.14,0.9 ; R17.1 85.16,1.44 ; 60.66,25.83 61.13,25.83 ; 60.66,25.83 59.88,25.83 C59.1 ; 60.66,25.83 v1(63.23,23.26) 63.7,23.26 ; 60.66,25.83 60.5,25.99 ; 61.13,25.83 60.98,25.99 60.5,25.99 ; 61.13,25.83 66.36,25.83 ; 61.13,25.83 63.7,23.26 ; 59.82,1.62 59.57,1.87 55.51,1.87 v1(54.49,0.85) 53.15,0.85 ; 59.82,1.62 C35.1 ; 59.82,1.62 59.82,4.41 59.84,4.43 ; 66.36,7.59 66.36,7.6 ; 66.36,7.59 66.35,7.6 ; 66.36,7.59 66.45,7.5 66.45,6.99 ; 66.36,7.59 66.36,7.08 66.45,6.99 ; 66.36,7.6 66.35,7.6 ; 66.36,7.6 C53.1 ; 37.82,11.15 37.82,9.53 37.56,9.28 37.31,9.28 v1(36.29,8.26) ; 137.9,1.8 137.81,1.8 ; 137.9,1.8 v1(137.9,6.78) ; 137.9,1.8 137.9,1.7 ; 137.81,1.8 137.65,1.96 137.14,1.96 ; 137.81,1.8 137.9,1.7 ; 137.81,1.8 137.3,1.8 ; C77.1 71.6,16.57 72.2,16.57 ; C77.1 71.59,16.82 72.32,17.55 ; C77.1 C36.1 ; C77.1 72.32,16.56 72.32,16.57 ; 71.85,20.12 71.85,18.85 72.32,18.37 ; 71.85,20.12 71.9,20.17 ; 71.85,20.12 71.36,20.6 ; 42.47,13.53 C74.1 ; 42.47,13.53 41.03,13.53 39.26,15.3 ; C87.1 71.69,25.74 71.69,21.61 ; C87.1 66.36,25.83 ; C87.1 71.59,21.71 71.69,21.61 ; 72.32,18.37 72.32,17.55 ; 72.32,18.37 72.36,18.34 72.36,17.58 72.32,17.55 ; 72.32,18.37 72.32,19.75 ; 72.32,17.55 72.32,16.69 ; 56.74,29.55 57.68,29.55 ; 56.74,29.55 56.83,29.64 59.51,29.64 59.6,29.55 ; 56.74,29.55 56.07,28.88 56.07,28.57 ; 56.74,29.55 55.82,29.55 C22.1 ; 57.68,29.55 57.59,29.64 ; 57.68,29.55 59.6,29.55 ; 57.68,29.55 58.54,28.7 C50.1 ; 101.51,5.8 101.51,5.8 C66.2 ; 101.51,5.8 101.51,6.05 98.97,8.59 98.73,8.59 ; 101.51,5.8 C66.2 ; 101.51,5.8 98.73,8.59 ; 57.29,21.72 v1(58.4,22.83) 58.4,24.86 57.64,25.62 ; 57.29,21.72 56.32,22.68 55.82,22.68 ; 57.29,21.72 57.13,21.56 55.82,21.56 ; 57.29,21.72 v1(57.59,21.41) ; C27.1 141.63,19.53 ; C27.1 C80.1 137.9,19.3 ; C27.1 141.86,20.25 ; 141.63,19.53 141.63,12.43 ; 141.63,19.53 141.86,19.53 141.86,20.25 ; C48.1 147.18,4.34 147.18,3.94 ; C48.1 147.18,3.94 ; C48.1 147.55,4.11 147.55,3.1 147.18,2.72 ; v1(137.79,14.87) 139.73,14.87 139.73,12.94 ; v1(137.79,14.87) v1(137.28,14.87) ; v1(137.79,14.87) 137.79,15.38 ; v1(137.79,14.87) 139.73,12.94 ; 67.72,10.53 67.72,10.32 ; 67.72,10.53 70.52,13.32 ; 67.72,10.53 67.72,13.32 70.52,13.32 ; 67.72,10.53 66.9,9.7 65.69,9.7 ; 67.72,10.32 67.72,8.96 ; 67.72,10.32 70.68,13.28 71.55,13.28 C36.1 ; 67.72,10.32 C53.1 ; 137.9,8.17 137.9,9.94 ; 137.9,8.17 137.78,8.17 ; 137.9,8.17 137.9,8.05 ; 137.9,9.94 136.96,9 ; 137.9,9.94 137.9,11.48 139.44,11.48 ; 137.9,9.94 139.44,11.48 ; C53.1 65.69,8.96 ; C53.1 67.72,8.96 ; 65.69,8.96 65.69,8.26 66.35,7.6 ; 65.69,8.96 65.69,9.7 ; 65.69,8.96 64.88,8.96 ; 53.15,0.85 51.29,0.85 ; 53.15,0.85 53.11,0.81 51.33,0.81 51.29,0.85 ; 53.15,0.85 53.36,1.07 53.36,1.25 ; 51.29,0.85 v1(49.92,0.85) ; 51.29,0.85 51.18,0.97 50.16,0.97 v1(49.91,1.22) ; 137.78,8.17 136.42,8.17 R27.2 ; 137.78,8.17 136.96,9 ; 137.78,8.17 137.9,8.05 ; 137.79,15.38 137.9,15.49 137.9,19.3 ; 137.79,15.38 137.79,19.19 137.9,19.3 ; 137.79,15.38 v1(137.28,14.87) ; 72.32,16.69 72.32,16.57 ; 72.32,16.69 72.45,16.82 72.45,19.62 72.32,19.75 ; 72.32,16.69 72.2,16.57 ; 62.44,7.03 60.82,5.4 ; 62.44,7.03 61.88,7.6 ; 62.44,7.03 63.01,7.6 ; 62.44,7.03 v1(63.06,6.42) ; 60.82,5.4 59.84,4.43 ; C70.1 45.86,20.28 v1(45.86,21.04) 45.52,21.04 43.24,23.32 ; C70.1 43.24,20.19 43.24,23.23 ; C70.1 45.77,20.7 v1(45.52,20.95) 43.24,23.23 ; 96.94,9.35 97.19,9.35 ; 96.94,9.35 97.19,9.1 ; 96.94,9.35 96.36,8.77 ; 97.19,9.35 97.96,9.35 98.54,8.77 ; 97.19,9.35 97.19,9.1 ; 53.87,4.81 52.6,6.08 v1(49.55,6.08) ; 53.87,4.81 53.87,1.76 53.36,1.25 ; 53.87,4.81 v1(55.4,6.33) 55.4,6.58 55.9,7.09 55.9,7.35 56.16,7.6 ; R14.1 103.16,29.2 114.65,29.2 U10.2 ; R14.1 103.16,25.08 ; R14.1 104.05,27.6 104.05,24.19 ; CARD1.11 133.12,9 R27.2 ; CARD1.11 132.18,4.76 R27.2 ; 66.36,20.78 63.99,23.14 63.82,23.14 ; 66.36,20.78 C78.1 ; 66.36,20.78 66.5,20.63 ; 66.36,20.78 66.36,25.83 ; 71.69,21.61 v1(72.36,20.94) 72.1,20.69 72.1,20.6 ; 71.69,21.61 71.69,20.6 ; 146.28,1.83 145.27,1.83 144.51,1.07 C6.1 137.9,1.7 ; 146.28,1.83 147.05,1.07 C23.1 ; 146.28,1.83 146.28,3.05 147.18,3.94 ; 146.28,1.83 146.41,1.83 C23.1 ; 146.28,1.83 147.18,2.72 ; 67.72,8.96 67.72,8.77 ; 36.71,12.26 38,10.97 38,9.53 v1(36.73,8.26) ; 104.05,24.19 103.16,25.08 ; 104.05,24.19 v1(104.05,23.93) 104.31,23.93 ; 104.05,24.19 104.31,23.93 ; 39.26,15.3 39.26,14.8 ; 70.52,13.32 70.71,13.51 71.59,13.51 ; 70.52,13.32 C36.1 ; 97.52,8.77 97.19,8.77 ; 97.52,8.77 97.19,9.1 ; 97.52,8.77 97.7,8.59 98.73,8.59 ; 97.52,8.77 98.54,8.77 ; 97.19,8.77 96.36,8.77 ; 97.19,8.77 97.19,9.1 ; 96.36,8.77 C69.1 ; 57.85,25.99 57.85,26.08 58,26.24 ; 57.85,25.99 58.61,25.99 ; 57.85,25.99 57.27,25.99 ; 57.85,25.99 58.1,26.24 ; 57.85,25.99 57.56,25.7 ; 57.85,25.99 57.85,25.83 57.64,25.62 ; C46.1 68.34,1.83 65.22,1.83 C67.2 ; C46.1 69.1,0.34 68.56,0.34 ; C46.1 69.03,1 69.03,0.81 68.56,0.34 ; C46.1 82.45,1.07 ; 103.16,25.08 103.16,23.86 v1(104.38,23.86) ; C21.1 28.08,9.22 29.6,9.22 ; C21.1 27.57,9.22 25.14,9.22 ; C21.1 25.39,8.96 ; C21.1 27.83,6.4 ; C21.1 28.27,8.52 C86.1 ; C21.1 29.35,8.96 ; C9.1 42.51,27.28 C68.1 41.24,27.19 v1(41.24,25.32) ; C9.1 v1(41.24,25.32) ; C9.1 43.24,24.05 43.24,23.32 ; C9.1 43.24,23.32 ; C9.1 42.51,23.96 43.24,23.23 ; C9.1 39.26,24.05 C7.1 ; 71.9,20.17 72.1,20.37 72.1,20.6 ; 71.9,20.17 71.69,20.38 71.69,20.6 ; 71.9,20.17 72.32,19.75 ; 43.24,23.23 43.24,23.32 ; 83.14,0.9 84.41,0.94 84.91,1.44 85.16,1.44 ; 83.14,0.9 82.45,0.9 82.45,1.07 ; 55.3,8.87 C88.1 55.19,8.25 ; 55.3,8.87 56.36,7.8 ; 55.3,8.87 55.4,8.87 56.41,7.85 ; 105.28,14.64 v1(105.57,14.64) ; 105.28,14.64 99.98,14.64 v1(99.3,13.96) 98.03,12.69 98.03,10.95 97.91,10.83 ; 105.28,14.64 105.28,23.86 ; 105.28,14.64 105.28,6.45 101.6,6.45 ; C66.2 102.84,4.47 ; C66.2 101.6,4.47 102.84,4.47 ; C66.2 101.6,6.45 ; 102.84,4.47 106.81,4.47 ; 66.45,6.99 C42.1 ; 123.93,14.36 124.38,14.8 ; 124.38,14.8 CARD1.6 ; 58.61,25.99 C59.1 ; 58.61,25.99 58.36,26.24 58.1,26.24 ; 72.32,16.57 72.2,16.57 ; 72.32,16.57 74.23,16.57 76.77,19.11 v1(78.8,19.11) ; 26.57,27.93 26.25,28.25 ; 26.57,27.93 v1(27.01,27.93) ; 26.57,27.93 25.93,27.93 25.74,27.75 22.44,27.75 ; 26.57,27.93 v1(26.8,27.7) C25.1 ; 26.25,28.25 C43.1 ; 26.25,28.25 30.36,28.25 C25.1 ; 56.07,28.37 56.07,28.57 ; 56.07,28.37 55.82,28.62 ; 56.07,28.37 56.58,28.88 56.58,29.39 ; 56.07,28.37 56.07,27.86 56.58,27.35 ; 56.07,28.57 C22.1 ; 42.49,13.48 39.26,13.48 39.26,14.8 ; 42.49,13.48 C74.1 ; C86.1 27.83,6.15 27.83,6.4 ; C86.1 28.27,4.11 ; C86.1 28.48,5.69 C3.1 ; C86.1 29.9,5.71 ; C23.1 147.18,2.72 ; 147.18,2.72 147.18,3.94 ; 71.36,20.6 66.53,20.6 ; 71.36,20.6 71.69,20.6 ; 101.6,6.45 101.6,8.77 98.54,8.77 ; C30.1 142.03,11.9 141.63,12.31 ; C30.1 144.12,11.19 ; C30.1 143.61,12.43 141.63,12.43 ; 42.75,1.21 42.75,5.69 ; 42.75,1.21 C8.1 ; 42.75,1.21 41.88,2.08 41.88,5.13 41.37,5.64 37.82,5.64 37.82,5.69 ; 42.75,1.21 42.82,1.14 ; 42.75,5.69 42.75,8.25 ; 42.75,5.69 37.82,5.69 ; 56.41,7.85 58.19,7.85 C32.2 ; 56.41,7.85 56.36,7.8 ; 56.36,7.8 56.16,7.6 ; 56.36,7.8 56.57,7.6 ; 56.16,7.6 55.19,7.6 55.19,8.25 ; 56.16,7.6 56.57,7.6 ; 29.6,9.22 29.9,9.51 ; 29.6,9.22 29.35,8.96 ; 29.9,9.51 29.9,8.96 ; 29.9,9.51 29.9,15.4 31.97,15.4 ; 29.9,9.51 v1(30.62,10.23) v1(30.87,10.49) ; C42.1 67.72,8.77 ; C42.1 64.46,5.72 C67.2 ; C42.1 67.84,5.74 68.86,5.74 69.62,6.51 70.38,6.51 v1(71.15,7.27) ; 67.72,8.77 C69.1 ; C89.1 136,14.36 CARD1.10 ; C89.1 v1(137.28,14.87) ; C89.1 136.25,14.86 129.39,14.86 CARD1.10 ; C89.1 128.31,14.87 128.31,14.36 ; 17.95,26.22 16.94,25.21 v1(16.94,24.95) ; 17.95,26.22 U5.4 19.79,26.36 ; 17.95,26.22 19.79,26.22 ; 23.41,23.23 23.26,23.37 23.26,23.59 23.41,23.73 ; 23.41,23.23 23.42,23.22 ; 23.41,23.23 23.41,23.73 ; 23.41,23.23 23.43,23.23 23.42,23.22 ; 38.75,14.8 39.26,14.8 ; 141.86,20.25 143.42,21.82 143.42,26.36 C52.1 141.86,27.26 141.86,20.25 ; v1(17.76,12.38) 17.76,12.89 v1(18.52,13.65) ; C8.1 42.82,1.14 ; C8.1 42.9,1.07 ; v1(137.28,14.87) 139.73,12.43 ; 59.84,1.08 61.88,1.08 62.62,0.34 ; 59.84,1.08 C35.1 ; 59.84,1.08 59.84,4.43 ; 55.82,22.68 55.82,23.95 55.82,23.96 ; 55.82,22.68 55.82,22.64 C72.1 ; 55.82,22.68 55.82,22.68 ; 23.42,23.22 23.17,22.97 23.17,17.89 23.43,17.64 v1(23.43,17.13) ; 19.87,12.3 23.17,15.61 23.43,15.61 v1(23.68,15.86) ; 19.87,12.3 22.16,10.02 ; 19.87,12.3 19.79,12.38 ; 141.63,12.31 141.5,12.43 ; 141.63,12.31 141.63,12.43 ; 141.63,12.31 141.63,11.19 ; 65.62,13.4 v1(65.18,13.85) ; 65.62,13.4 65.62,13.51 65.37,13.77 v1(65.37,14.15) ; 65.62,13.4 65.62,9.7 ; 65.62,13.4 65.69,13.34 65.69,9.7 ; 21.57,26.36 22.44,26.36 22.44,27.24 ; 21.57,26.36 20.56,26.36 ; 21.57,26.36 22.44,27.24 ; 21.57,26.36 21.43,26.22 ; 132.7,1.8 132.86,1.96 133.08,1.96 ; 132.7,1.8 131.87,0.97 ; 132.7,1.8 132.91,1.8 ; 132.7,1.8 131.87,1.8 131.87,0.97 ; 104.31,23.93 v1(104.38,23.86) ; 104.31,23.93 106.24,23.93 U8.2 105.28,23.86 ; 136.96,9 R27.2 ; 27.83,6.4 26.3,6.4 22.24,2.34 22.23,1.8 ; 85.16,1.44 84.65,0.93 83.15,0.93 C26.2 82.45,1.07 ; 19.79,12.38 19.79,10.02 22.16,10.02 ; 19.79,12.38 v1(18.52,13.65) ; 19.79,12.38 19.79,26.22 ; 72.1,20.6 72.32,20.6 72.32,19.75 ; 72.1,20.6 71.69,20.6 ; v1(31.72,15.66) 34.45,15.66 34.7,15.4 ; v1(31.72,15.66) v1(31.4,15.66) ; v1(31.72,15.66) 31.97,15.4 ; CARD1.13 114.28,14.61 114.03,14.86 ; CARD1.13 113.38,13.46 CARD1.12 ; CARD1.13 114.03,14.61 114.03,14.86 ; CARD1.13 114.28,5.66 ; C22.1 55.82,28.82 55.82,28.62 55.82,28.62 ; C22.1 55.82,28.62 ; 114.28,5.66 CARD1.12 ; 23.41,23.73 21.43,25.72 21.43,26.22 ; 133.08,1.96 137.14,1.96 ; 133.08,1.96 132.91,1.8 ; 133.08,1.96 137.14,1.96 ; 137.3,1.8 137.39,1.7 137.9,1.7 ; 137.3,1.8 137.14,1.96 ; 137.3,1.8 132.91,1.8 ; 22.23,1.8 22.96,1.8 ; 29.9,8.96 29.35,8.96 ; 29.9,8.96 29.9,5.71 ; CARD1.12 109.93,4.76 109.64,4.47 ; CARD1.12 113.09,4.47 ; CARD1.12 113.38,4.47 113.09,4.47 ; 55.82,22.68 55.82,23.96 ; 55.82,22.68 55.82,21.56 ; 55.82,23.96 55.82,25.99 ; 55.82,23.96 57.56,25.7 ; 114.03,14.86 v1(113.54,15.35) ; 114.03,14.86 v1(114.03,15.37) ; 58.61,26.85 58.61,26.75 59.12,26.75 C59.1 ; 58.61,26.85 58,26.24 ; 58.61,26.85 58.1,27.35 56.58,27.35 ; 55.19,8.25 42.75,8.25 ; 66.35,7.6 63.01,7.6 ; 63.01,7.6 61.88,7.6 ; 63.01,7.6 v1(64.37,8.96) ; 64.88,8.96 v1(64.37,8.96) ; 64.88,8.96 65.62,9.7 ; 64.88,8.96 v1(64.37,8.96) ; v1(64.37,8.96) v1(63.82,8.96) ; 65.69,9.7 65.62,9.7 ; 29.9,5.71 31.5,5.71 ; 31.5,5.71 C3.1 ; 31.5,5.71 31.52,5.71 C3.1 ; 60.55,0.34 59.82,0.34 C35.1 ; 60.55,0.34 C35.1 ; 60.55,0.34 62.62,0.34 ; 60.55,0.34 60.59,0.3 63.7,0.3 63.73,0.34 ; 55.82,21.56 55.82,21.55 C72.1 ; 55.82,21.56 54.84,21.56 C72.1 ; 139.73,12.18 140.23,12.18 140.49,12.43 ; 139.73,12.18 139.73,12.43 ; 139.73,12.18 139.98,12.43 140.49,12.43 ; 37.82,5.69 C3.1 ; 37.82,5.69 37.82,5.72 v1(37.31,6.23) 36.8,5.72 31.72,5.72 C3.1 ; 66.53,20.6 C78.1 ; 66.53,20.6 66.5,20.63 ; 57.64,25.62 57.56,25.7 ; 55.82,28.62 55.82,25.99 ; 58.1,26.24 58,26.24 ; 141.63,12.43 141.5,12.43 ; v1(41.24,25.32) 40.74,24.81 39.28,24.81 v1(38.61,25.48) ; C69.1 94.09,8.84 v1(94.65,8.84) 96.43,8.84 ; C78.1 63.82,23.14 ; C78.1 66.39,20.63 66.5,20.63 ; 42.9,1.07 42.82,1.14 ; 42.9,1.07 44.42,1.07 45.04,1.68 ; 42.82,1.14 43.37,1.68 45.04,1.68 ; 25.39,8.96 24.34,10.02 ; 25.39,8.96 24.34,8.96 24.34,10.02 ; 58,26.24 57.69,26.24 56.58,27.35 ; 22.96,1.8 24.99,3.83 v1(27.98,3.83) 28.27,4.11 ; 22.96,1.8 28.27,1.8 28.27,4.11 ; 62.62,0.34 63.67,0.34 ; 62.62,0.34 62.64,0.32 63.65,0.32 63.67,0.34 ; 113.09,4.47 109.64,4.47 ; v1(18.52,13.65) v1(18.52,14.16) ; 131.87,0.97 132.09,0.97 132.91,1.8 ; 66.5,20.63 71.69,20.6 ; 98.73,8.59 98.54,8.77 ; 137.9,8.05 v1(137.9,6.78) ; 137.9,8.05 v1(137.9,6.78) ; CARD1.10 128.31,14.36 ; 63.67,0.34 64.16,0.83 C67.2 ; 63.67,0.34 63.73,0.34 ; 139.73,12.43 139.73,12.94 ; 59.6,29.55 60.46,29.55 C50.1 ; 59.6,29.55 C50.1 ; 106.81,4.47 109.64,4.47 ; 106.81,4.47 106.96,4.32 108.99,4.32 v1(109.24,4.07) 109.64,4.47 ; C43.1 20.56,26.36 ; C43.1 22.44,27.75 ; 20.56,26.36 19.79,26.36 ; 57.27,25.99 57.56,25.7 ; 57.27,25.99 55.82,25.99 ; v1(53.11,1.57) 53.36,1.32 53.36,1.25 ; 63.73,0.34 64.46,0.34 ; 63.73,0.34 C67.2 ; 22.44,27.75 22.44,27.24 ; C25.1 30.39,24.11 ; C47.1 147.58,7.6 ; 59.84,7.6 C32.2 ; 59.84,7.6 61.88,7.6 ; 97.91,10.83 97.91,12.23 97.66,12.48 97.66,13.75 v1(97.91,14.01) ; 141.5,12.43 140.49,12.43 ; 31.97,15.4 34.7,15.4 ; 24.34,10.02 22.16,10.02 ; v1(104.38,23.86) 105.28,23.86 ; C72.1 C75.1 v1(50.18,21.55) 49.92,21.55 v1(49.67,21.3) ; 147.58,7.6 144.12,7.6 144.12,11.19 ; 19.79,26.22 19.79,26.36 ; 19.79,26.22 21.43,26.22 ; C32.2 56.57,7.6 ; 64.46,0.34 C67.2 ; 64.46,0.34 67.22,0.34 ; C67.2 66.49,1.07 67.22,0.34 ; 60.5,25.99 C59.1 ; 67.22,0.34 68.56,0.34 ; 67.22,0.34 67.25,0.3 68.52,0.3 68.56,0.34 ; 141.63,11.19 144.12,11.19 ; 45.04,1.68 v1(45.34,1.98) ; 45.04,1.68 v1(45.24,1.68) ; 30.39,24.11 v1(30.39,20.48) ; 30.39,24.11 30.66,23.84 v1(30.66,20.25)
